# Altium project RTM_SFP.PrjPcb (part 2 of 2)

## Sheet Serial_Registers.SchDoc: Serial Registers
size 420 x 297 mm; Organization: Altium Limited; Address1: L3, 12a Rodborough Rd; Address2: Frenchs Forest; Address3: NSW; Address4: Australia 2086; SheetNumber: 6; SheetTotal: 8
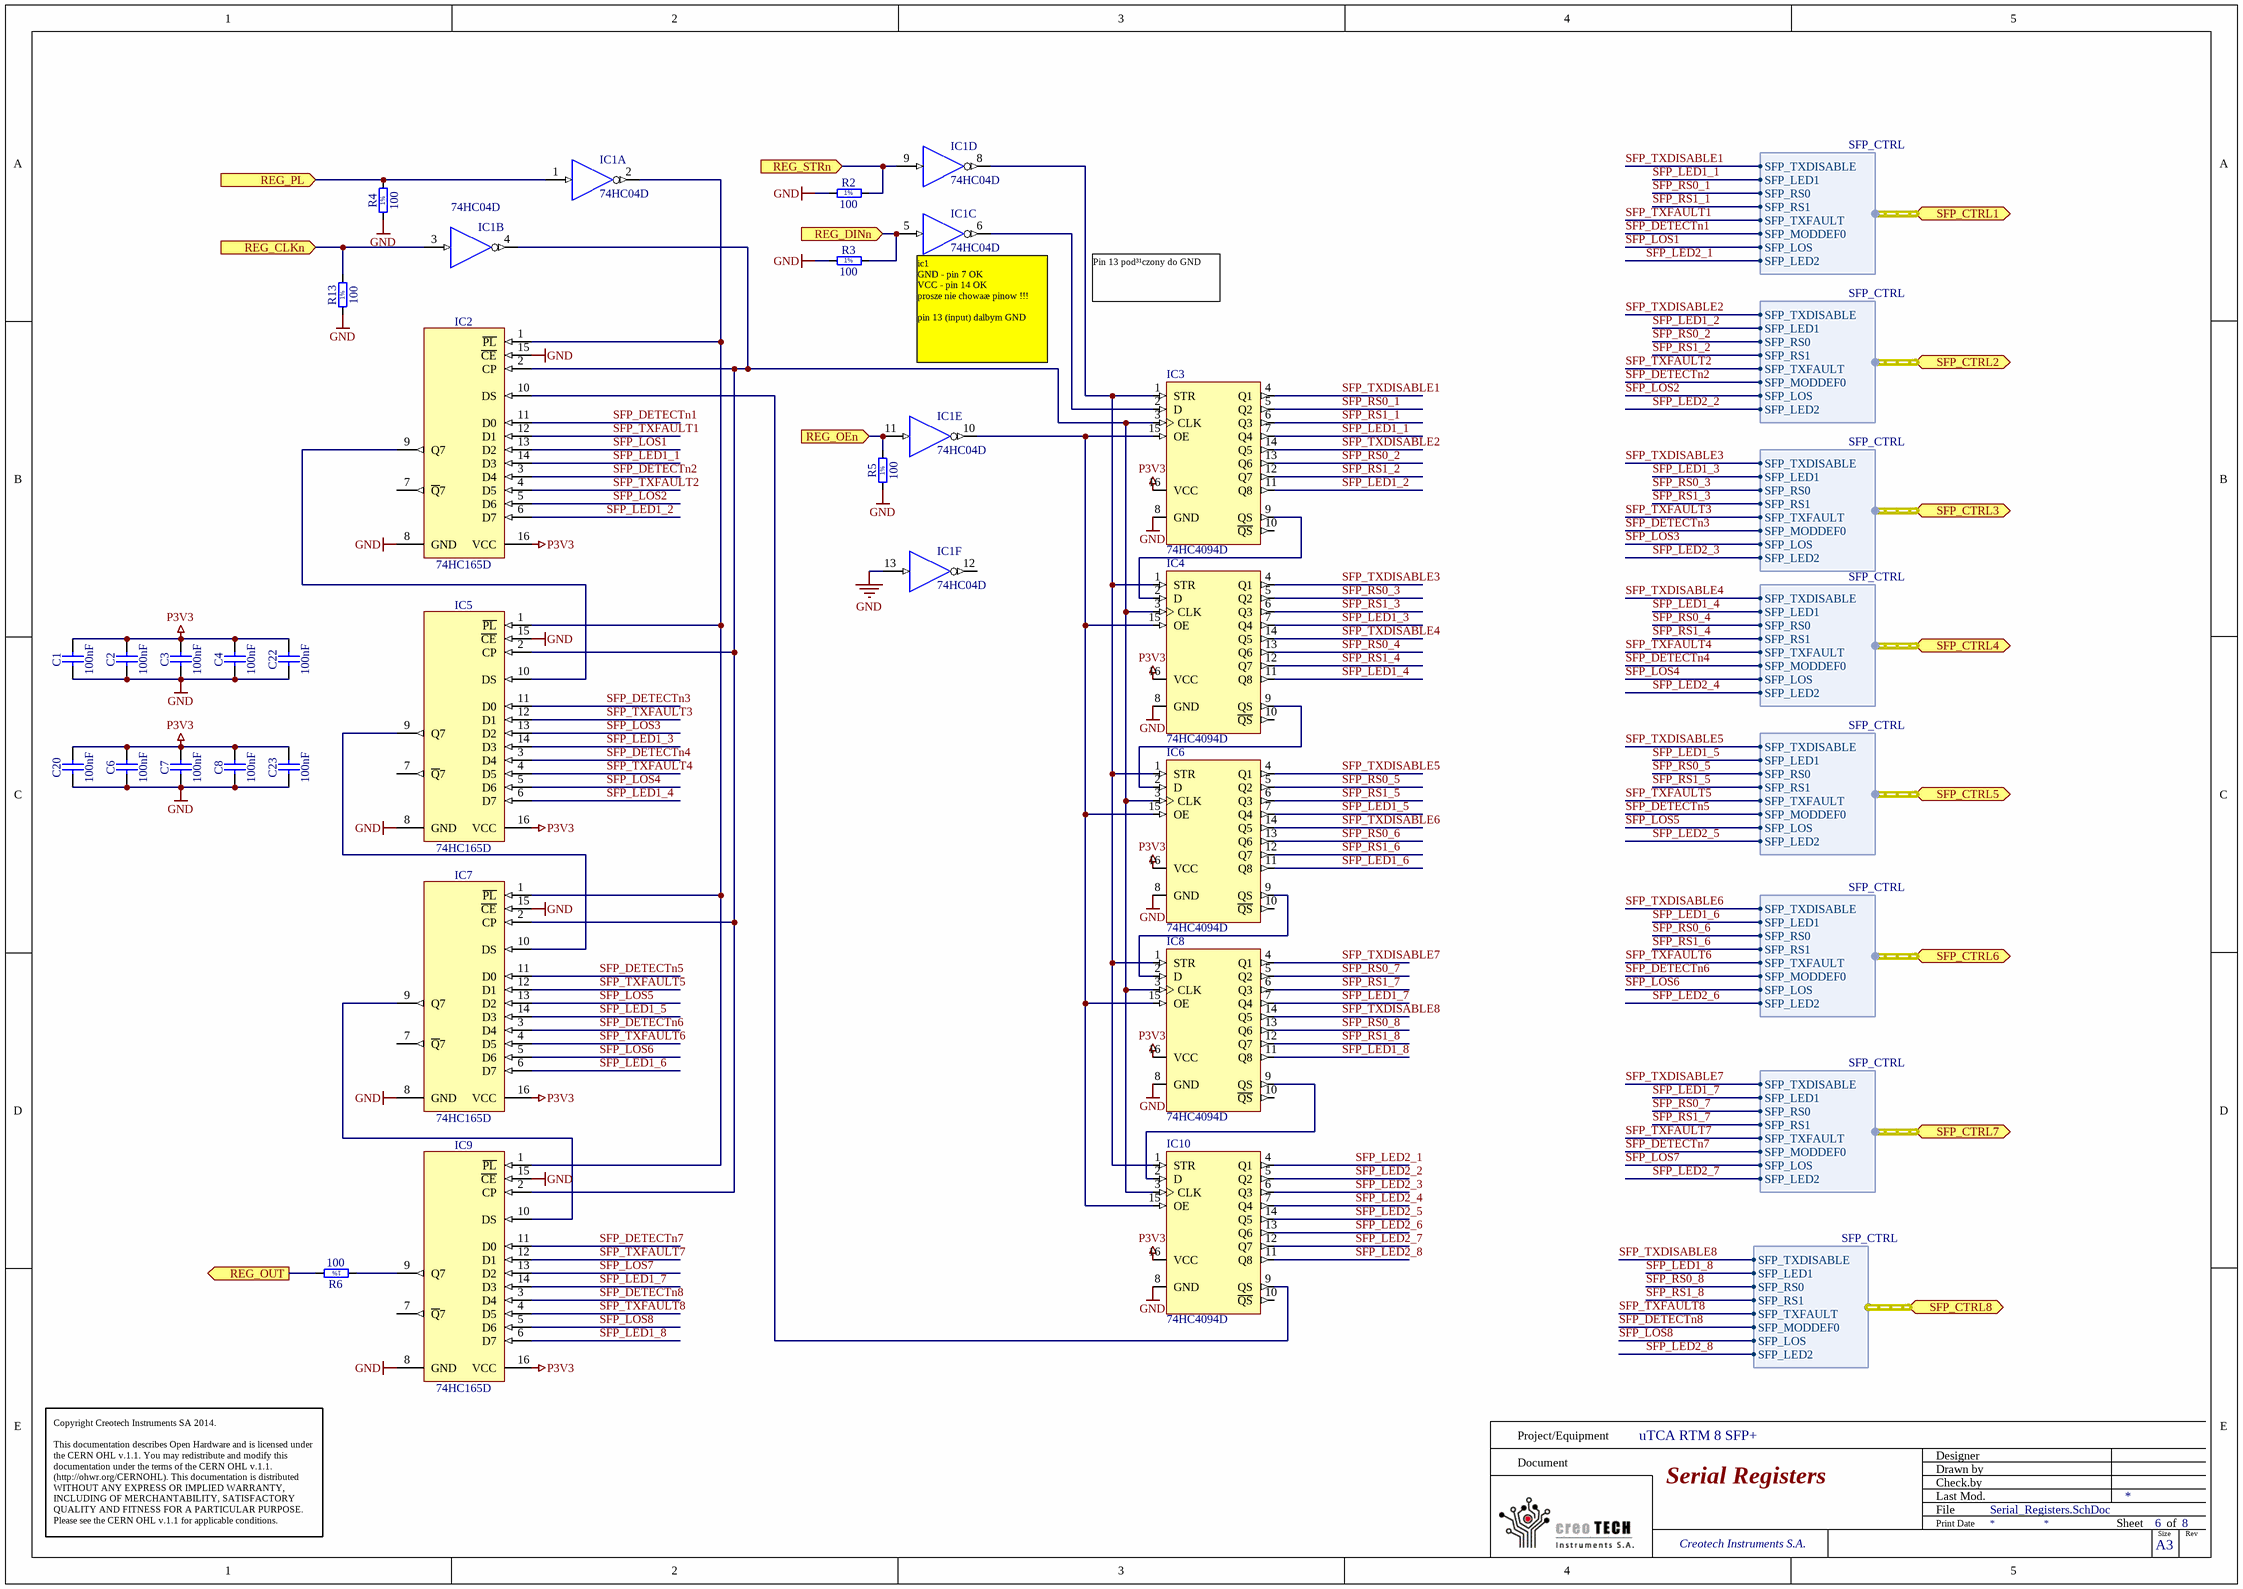
[diagram p4: Serial_Registers.SchDoc]

### Parts
C1  100nF  [CAPC1005X55N]
C2  100nF  [CAPC1005X55N]
C3  100nF  [CAPC1005X55N]
C4  100nF  [CAPC1005X55N]
C6  100nF  [CAPC1005X55N]
C7  100nF  [CAPC1005X55N]
C8  100nF  [CAPC1005X55N]
C20  100nF  [CAPC1005X55N]
C22  100nF  [CAPC1005X55N]
C23  100nF  [CAPC1005X55N]
IC1  74HC04D  [SOIC127P600X175-14N]  (parts A,B,C,D,E,F of 6)
IC2  74HC165D  [SOIC127P600X175-16N]
IC3  74HC4094D  [SO-16]
IC4  74HC4094D  [SO-16]
IC5  74HC165D  [SOIC127P600X175-16N]
IC6  74HC4094D  [SO-16]
IC7  74HC165D  [SOIC127P600X175-16N]
IC8  74HC4094D  [SO-16]
IC9  74HC165D  [SOIC127P600X175-16N]
IC10  74HC4094D  [SO-16]
R2  100  [RESC1608X55N]
R3  100  [RESC1608X55N]
R4  100  [RESC1608X55N]
R5  100  [RESC1608X55N]
R6  100  [RESC1608X55N]
R13  100  [RESC1608X55N]

### Ports
REG_CLKn (in), REG_DINn (in), REG_OEn (in), REG_OUT (out), REG_PL (in), REG_STRn (in), SFP_CTRL1 (harness SFP_CTRL), SFP_CTRL2 (harness SFP_CTRL), SFP_CTRL3 (harness SFP_CTRL), SFP_CTRL4 (harness SFP_CTRL), SFP_CTRL5 (harness SFP_CTRL), SFP_CTRL6 (harness SFP_CTRL), SFP_CTRL7 (harness SFP_CTRL), SFP_CTRL8 (harness SFP_CTRL)

### Harnesses
SFP_CTRL: SFP_LED1, SFP_TXFAULT, SFP_TXDISABLE, SFP_MODDEF0, SFP_RS0, SFP_RS1, SFP_LOS, SFP_LED2

### Nets
GND: C1.2 C2.2 C3.2 C4.2 C6.2 C7.2 C8.2 C20.2 C22.2 C23.2 IC1.7(GND) IC1.13(A) IC2.8(GND) IC2.15(~{CE}) IC3.8(GND) IC4.8(GND) IC5.8(GND) IC5.15(~{CE}) IC6.8(GND) IC7.8(GND) IC7.15(~{CE}) IC8.8(GND) IC9.8(GND) IC9.15(~{CE}) IC10.8(GND) R2.1 R3.1 R4.1 R5.1 R13.1
P3V3: C1.1 C2.1 C3.1 C4.1 C6.1 C7.1 C8.1 C20.1 C22.1 C23.1 IC1.14(VCC) IC2.16(VCC) IC3.16(VCC) IC4.16(VCC) IC5.16(VCC) IC6.16(VCC) IC7.16(VCC) IC8.16(VCC) IC9.16(VCC) IC10.16(VCC)
RTM_IO1: R6.2 ; port REG_OUT
RTM_IO2: IC1.11(A) R5.2 ; port REG_OEn
RTM_IO3: IC1.3(A) R13.2 ; port REG_CLKn
RTM_IO4: IC1.9(A) R2.2 ; port REG_STRn
RTM_IO5: IC1.5(A) R3.2 ; port REG_DINn
RTM_IO6: IC1.1(A) R4.2 ; port REG_PL
SFP_DETECTn1: IC2.11(D0) ; port SFP_CTRL1.SFP_MODDEF0
SFP_DETECTn2: IC2.3(D4) ; port SFP_CTRL2.SFP_MODDEF0
SFP_DETECTn3: IC5.11(D0) ; port SFP_CTRL3.SFP_MODDEF0
SFP_DETECTn4: IC5.3(D4) ; port SFP_CTRL4.SFP_MODDEF0
SFP_DETECTn5: IC7.11(D0) ; port SFP_CTRL5.SFP_MODDEF0
SFP_DETECTn6: IC7.3(D4) ; port SFP_CTRL6.SFP_MODDEF0
SFP_DETECTn7: IC9.11(D0) ; port SFP_CTRL7.SFP_MODDEF0
SFP_DETECTn8: IC9.3(D4) ; port SFP_CTRL8.SFP_MODDEF0
SFP_LED1_1: IC2.14(D3) IC3.7(Q4) ; port SFP_CTRL1.SFP_LED1  [project net SFP_LED1]
SFP_LED1_2: IC2.6(D7) IC3.11(Q8) ; port SFP_CTRL2.SFP_LED1  [project net SFP_LED1]
SFP_LED1_3: IC4.7(Q4) IC5.14(D3) ; port SFP_CTRL3.SFP_LED1  [project net SFP_LED1]
SFP_LED1_4: IC4.11(Q8) IC5.6(D7) ; port SFP_CTRL4.SFP_LED1  [project net SFP_LED1]
SFP_LED1_5: IC6.7(Q4) IC7.14(D3) ; port SFP_CTRL5.SFP_LED1  [project net SFP_LED1]
SFP_LED1_6: IC6.11(Q8) IC7.6(D7) ; port SFP_CTRL6.SFP_LED1  [project net SFP_LED1]
SFP_LED1_7: IC8.7(Q4) IC9.14(D3) ; port SFP_CTRL7.SFP_LED1  [project net SFP_LED1]
SFP_LED1_8: IC8.11(Q8) IC9.6(D7) ; port SFP_CTRL8.SFP_LED1  [project net SFP_LED1]
SFP_LED2_1: IC10.4(Q1) ; port SFP_CTRL1.SFP_LED2  [project net SFP_LED2]
SFP_LED2_2: IC10.5(Q2) ; port SFP_CTRL2.SFP_LED2  [project net SFP_LED2]
SFP_LED2_3: IC10.6(Q3) ; port SFP_CTRL3.SFP_LED2  [project net SFP_LED2]
SFP_LED2_4: IC10.7(Q4) ; port SFP_CTRL4.SFP_LED2  [project net SFP_LED2]
SFP_LED2_5: IC10.14(Q5) ; port SFP_CTRL5.SFP_LED2  [project net SFP_LED2]
SFP_LED2_6: IC10.13(Q6) ; port SFP_CTRL6.SFP_LED2  [project net SFP_LED2]
SFP_LED2_7: IC10.12(Q7) ; port SFP_CTRL7.SFP_LED2  [project net SFP_LED2]
SFP_LED2_8: IC10.11(Q8) ; port SFP_CTRL8.SFP_LED2  [project net SFP_LED2]
SFP_LOS1: IC2.13(D2) ; port SFP_CTRL1.SFP_LOS  [project net SFP_LOS]
SFP_LOS2: IC2.5(D6) ; port SFP_CTRL2.SFP_LOS  [project net SFP_LOS]
SFP_LOS3: IC5.13(D2) ; port SFP_CTRL3.SFP_LOS  [project net SFP_LOS]
SFP_LOS4: IC5.5(D6) ; port SFP_CTRL4.SFP_LOS  [project net SFP_LOS]
SFP_LOS5: IC7.13(D2) ; port SFP_CTRL5.SFP_LOS  [project net SFP_LOS]
SFP_LOS6: IC7.5(D6) ; port SFP_CTRL6.SFP_LOS  [project net SFP_LOS]
SFP_LOS7: IC9.13(D2) ; port SFP_CTRL7.SFP_LOS  [project net SFP_LOS]
SFP_LOS8: IC9.5(D6) ; port SFP_CTRL8.SFP_LOS  [project net SFP_LOS]
SFP_RS0_1: IC3.5(Q2) ; port SFP_CTRL1.SFP_RS0  [project net SFP_RS0]
SFP_RS0_2: IC3.13(Q6) ; port SFP_CTRL2.SFP_RS0  [project net SFP_RS0]
SFP_RS0_3: IC4.5(Q2) ; port SFP_CTRL3.SFP_RS0  [project net SFP_RS0]
SFP_RS0_4: IC4.13(Q6) ; port SFP_CTRL4.SFP_RS0  [project net SFP_RS0]
SFP_RS0_5: IC6.5(Q2) ; port SFP_CTRL5.SFP_RS0  [project net SFP_RS0]
SFP_RS0_6: IC6.13(Q6) ; port SFP_CTRL6.SFP_RS0  [project net SFP_RS0]
SFP_RS0_7: IC8.5(Q2) ; port SFP_CTRL7.SFP_RS0  [project net SFP_RS0]
SFP_RS0_8: IC8.13(Q6) ; port SFP_CTRL8.SFP_RS0  [project net SFP_RS0]
SFP_RS1_1: IC3.6(Q3) ; port SFP_CTRL1.SFP_RS1  [project net SFP_RS1]
SFP_RS1_2: IC3.12(Q7) ; port SFP_CTRL2.SFP_RS1  [project net SFP_RS1]
SFP_RS1_3: IC4.6(Q3) ; port SFP_CTRL3.SFP_RS1  [project net SFP_RS1]
SFP_RS1_4: IC4.12(Q7) ; port SFP_CTRL4.SFP_RS1  [project net SFP_RS1]
SFP_RS1_5: IC6.6(Q3) ; port SFP_CTRL5.SFP_RS1  [project net SFP_RS1]
SFP_RS1_6: IC6.12(Q7) ; port SFP_CTRL6.SFP_RS1  [project net SFP_RS1]
SFP_RS1_7: IC8.6(Q3) ; port SFP_CTRL7.SFP_RS1  [project net SFP_RS1]
SFP_RS1_8: IC8.12(Q7) ; port SFP_CTRL8.SFP_RS1  [project net SFP_RS1]
SFP_TXDISABLE1: IC3.4(Q1) ; port SFP_CTRL1.SFP_TXDISABLE  [project net SFP_TXDISABLE]
SFP_TXDISABLE2: IC3.14(Q5) ; port SFP_CTRL2.SFP_TXDISABLE  [project net SFP_TXDISABLE]
SFP_TXDISABLE3: IC4.4(Q1) ; port SFP_CTRL3.SFP_TXDISABLE  [project net SFP_TXDISABLE]
SFP_TXDISABLE4: IC4.14(Q5) ; port SFP_CTRL4.SFP_TXDISABLE  [project net SFP_TXDISABLE]
SFP_TXDISABLE5: IC6.4(Q1) ; port SFP_CTRL5.SFP_TXDISABLE  [project net SFP_TXDISABLE]
SFP_TXDISABLE6: IC6.14(Q5) ; port SFP_CTRL6.SFP_TXDISABLE  [project net SFP_TXDISABLE]
SFP_TXDISABLE7: IC8.4(Q1) ; port SFP_CTRL7.SFP_TXDISABLE  [project net SFP_TXDISABLE]
SFP_TXDISABLE8: IC8.14(Q5) ; port SFP_CTRL8.SFP_TXDISABLE  [project net SFP_TXDISABLE]
SFP_TXFAULT1: IC2.12(D1) ; port SFP_CTRL1.SFP_TXFAULT  [project net SFP_TXFAULT]
SFP_TXFAULT2: IC2.4(D5) ; port SFP_CTRL2.SFP_TXFAULT  [project net SFP_TXFAULT]
SFP_TXFAULT3: IC5.12(D1) ; port SFP_CTRL3.SFP_TXFAULT  [project net SFP_TXFAULT]
SFP_TXFAULT4: IC5.4(D5) ; port SFP_CTRL4.SFP_TXFAULT  [project net SFP_TXFAULT]
SFP_TXFAULT5: IC7.12(D1) ; port SFP_CTRL5.SFP_TXFAULT  [project net SFP_TXFAULT]
SFP_TXFAULT6: IC7.4(D5) ; port SFP_CTRL6.SFP_TXFAULT  [project net SFP_TXFAULT]
SFP_TXFAULT7: IC9.12(D1) ; port SFP_CTRL7.SFP_TXFAULT  [project net SFP_TXFAULT]
SFP_TXFAULT8: IC9.4(D5) ; port SFP_CTRL8.SFP_TXFAULT  [project net SFP_TXFAULT]
NetIC1_2: IC1.2(~{O}) IC2.1(~{PL}) IC5.1(~{PL}) IC7.1(~{PL}) IC9.1(~{PL})
NetIC1_4: IC1.4(~{O}) IC2.2(CP) IC3.3(CLK) IC4.3(CLK) IC5.2(CP) IC6.3(CLK) IC7.2(CP) IC8.3(CLK) IC9.2(CP) IC10.3(CLK)
NetIC1_6: IC1.6(~{O}) IC3.2(D)
NetIC1_8: IC1.8(~{O}) IC3.1(STR) IC4.1(STR) IC6.1(STR) IC8.1(STR) IC10.1(STR)
NetIC1_10: IC1.10(~{O}) IC3.15(OE) IC4.15(OE) IC6.15(OE) IC8.15(OE) IC10.15(OE)
NetIC2_9: IC2.9(Q7) IC5.10(DS)
NetIC2_10: IC2.10(DS) IC10.9(QS)
NetIC3_9: IC3.9(QS) IC4.2(D)
NetIC4_9: IC4.9(QS) IC6.2(D)
NetIC5_9: IC5.9(Q7) IC7.10(DS)
NetIC6_9: IC6.9(QS) IC8.2(D)
NetIC7_9: IC7.9(Q7) IC9.10(DS)
NetIC8_9: IC8.9(QS) IC10.2(D)
NetIC9_9: IC9.9(Q7) R6.1

Not connected (* = marked no-connect by the designer): IC1 12(~{O}); IC2 7(~{Q}7); IC3 10(~{QS}); IC4 10(~{QS}); IC5 7(~{Q}7); IC6 10(~{QS}); IC7 7(~{Q}7); IC8 10(~{QS}); IC9 7(~{Q}7); IC10 10(~{QS})

### Notes on the sheet
- Pin 13 pod³¹czony do GND
- (near IC1) ic1
  GND - pin 7 OK
  VCC - pin 14 OK
  prosze nie chowaæ pinow !!!
  pin 13 (input) dalbym GND
- Project/Equipment
- Document
- uTCA RTM 8 SFP+
- Designer
- Drawn by
- Check.by
- Copyright Creotech Instruments SA 2014.
  This documentation describes Open Hardware and is licensed under the CERN OHL v.1.1. You may redistribute and modify this documentation under the terms of the CERN OHL v.1.1. (http://ohwr.org/CERNOHL). This documentation is distributed WITHOUT ANY EXPRESS OR IMPLIED WARRANTY, INCLUDING OF MERCHANTABILITY, SATISFACTORY QUALITY AND FITNESS FOR A PARTICULAR PURPOSE. Please see the CERN OHL v.1.1 for applicable conditions.
- Creotech Instruments S.A.
- File
- Last Mod.
- Print Date
- Sheet
- Size
- A3
- of
- Rev
- (in symbol R0603_100R_1%_0.1W_100PPM) 1%

### Library data of the parts
C1-C4 C6-C8 C20 C22 C23 = CC0402_100NF_16V_10%_X7R: Non-polarised capacitor; Part Description: SMD Multilayer Chip Ceramic Capacitor; Manufacturer: GENERIC; Manufacturer1 Part Number: 223878715649; Voltage: 16V; TC: X7R; Tolerance: ±10%; Table: Capacitors SMD; Part Number: CC0402_100NF_16V_10%_X7R; Component Kind: Standard; Component Type: Standard; Pin Count: 2; Value: 100nF; Status: Not Recommended; Manufacturer Part Number: CC0402_100NF_16V_10%_X7R; Case: 0402; Mounted: Yes; Socket: No; SMD: Yes; Manufacturer1 Example: PHYCOMP; Manufacturer1 ComponentHeight: 0.55mm; HelpURL: \\cern.ch\dfs\Applications\Altium\Datasheets\CC0402_X7R_PHYCOMP.pdf; Author: CERN DEM JLC; CreateDate: 12/3/2007; LatestRevisionDate: 12/3/2007
IC1 = 74HC04D: Hex Inverter; Part Description: Hex Inverters; Manufacturer: NXP SEMICONDUCTORS; Table: Standard Logic; Part Number: 74HC04D; Component Kind: Standard; Component Type: Standard; Device: 74HC04D; PackageDescription: SOIC 14, Pitch 1.27mm - Body 4x8.75mm, IPC Medium Density; Manufacturer Part Number: 74HC04D; Pin Count: 12; Case: SOIC14; Mounted: Yes; Socket: No; SMD: Yes; ComponentHeight: 1.75mm; Author: CERN DEM JLC; HelpURL: \\cern.ch\dfs\Applications\Altium\Datasheets\74HC04D.pdf; CreateDate: 2011-04-06; LatestRevisionDate: 2011-04-06
IC2 IC5 IC7 IC9 = 74HC165D: 8-Bit Parallel-In/Serial Out Shift Register; Manufacturer: NXP SEMICONDUCTORS; Table: Standard Logic; Part Number: 74HC165D; Component Kind: Standard; Component Type: Standard; Device: 74HC165D; PackageDescription: SOIC 16, Pitch 1.27mm - Body 4x10mm, IPC Medium Density; Part Description: 8-Bit Parallel-In/Serial Out Shift Register; Manufacturer Part Number: 74HC165D; Pin Count: 16; Case: SOIC16; Mounted: Yes; Socket: No; SMD: Yes; ComponentHeight: 1.75mm; Author: CERN DEM JLC; HelpURL: \\cern.ch\dfs\Applications\Altium\Datasheets\74HC165D.pdf; CreateDate: 2012-04-26; LatestRevisionDate: 2012-04-26
IC3 IC4 IC6 IC8 IC10 = 4094: shift register
R2-R6 R13 = R0603_100R_1%_0.1W_100PPM: Resistor - 1%; Part Description: General Purpose Thick Film Chip Resistor; Manufacturer: GENERIC; Manufacturer1 Part Number: NRC06F4700TRF; Power: 0.1W; TC: ±100ppm/°C; Table: Resistors SMD; Part Number: R0603_100R_1%_0.1W_100PPM; Component Kind: Standard; Component Type: Standard; Pin Count: 2; Value: 100; Status: Preferred; Tolerance: ±1%; Manufacturer Part Number: R0603_100R_1%_0.1W_100PPM; Case: 0603; Mounted: Yes; Socket: No; SMD: Yes; Manufacturer1 Example: NIC COMPONENT; Manufacturer1 ComponentHeight: 0.55mm; HelpURL: \\cern.ch\dfs\Applications\Altium\Datasheets\R0603_NIC_NRC.pdf; Author: CERN DEM JLC; CreateDate: 12/3/2007; LatestRevisionDate: 3/13/2008

## Sheet RTM_Connectors.SchDoc
size A3; Organization: Altium Limited; Address1: L3, 12a Rodborough Rd; Address2: Frenchs Forest; Address3: NSW; Address4: Australia 2086
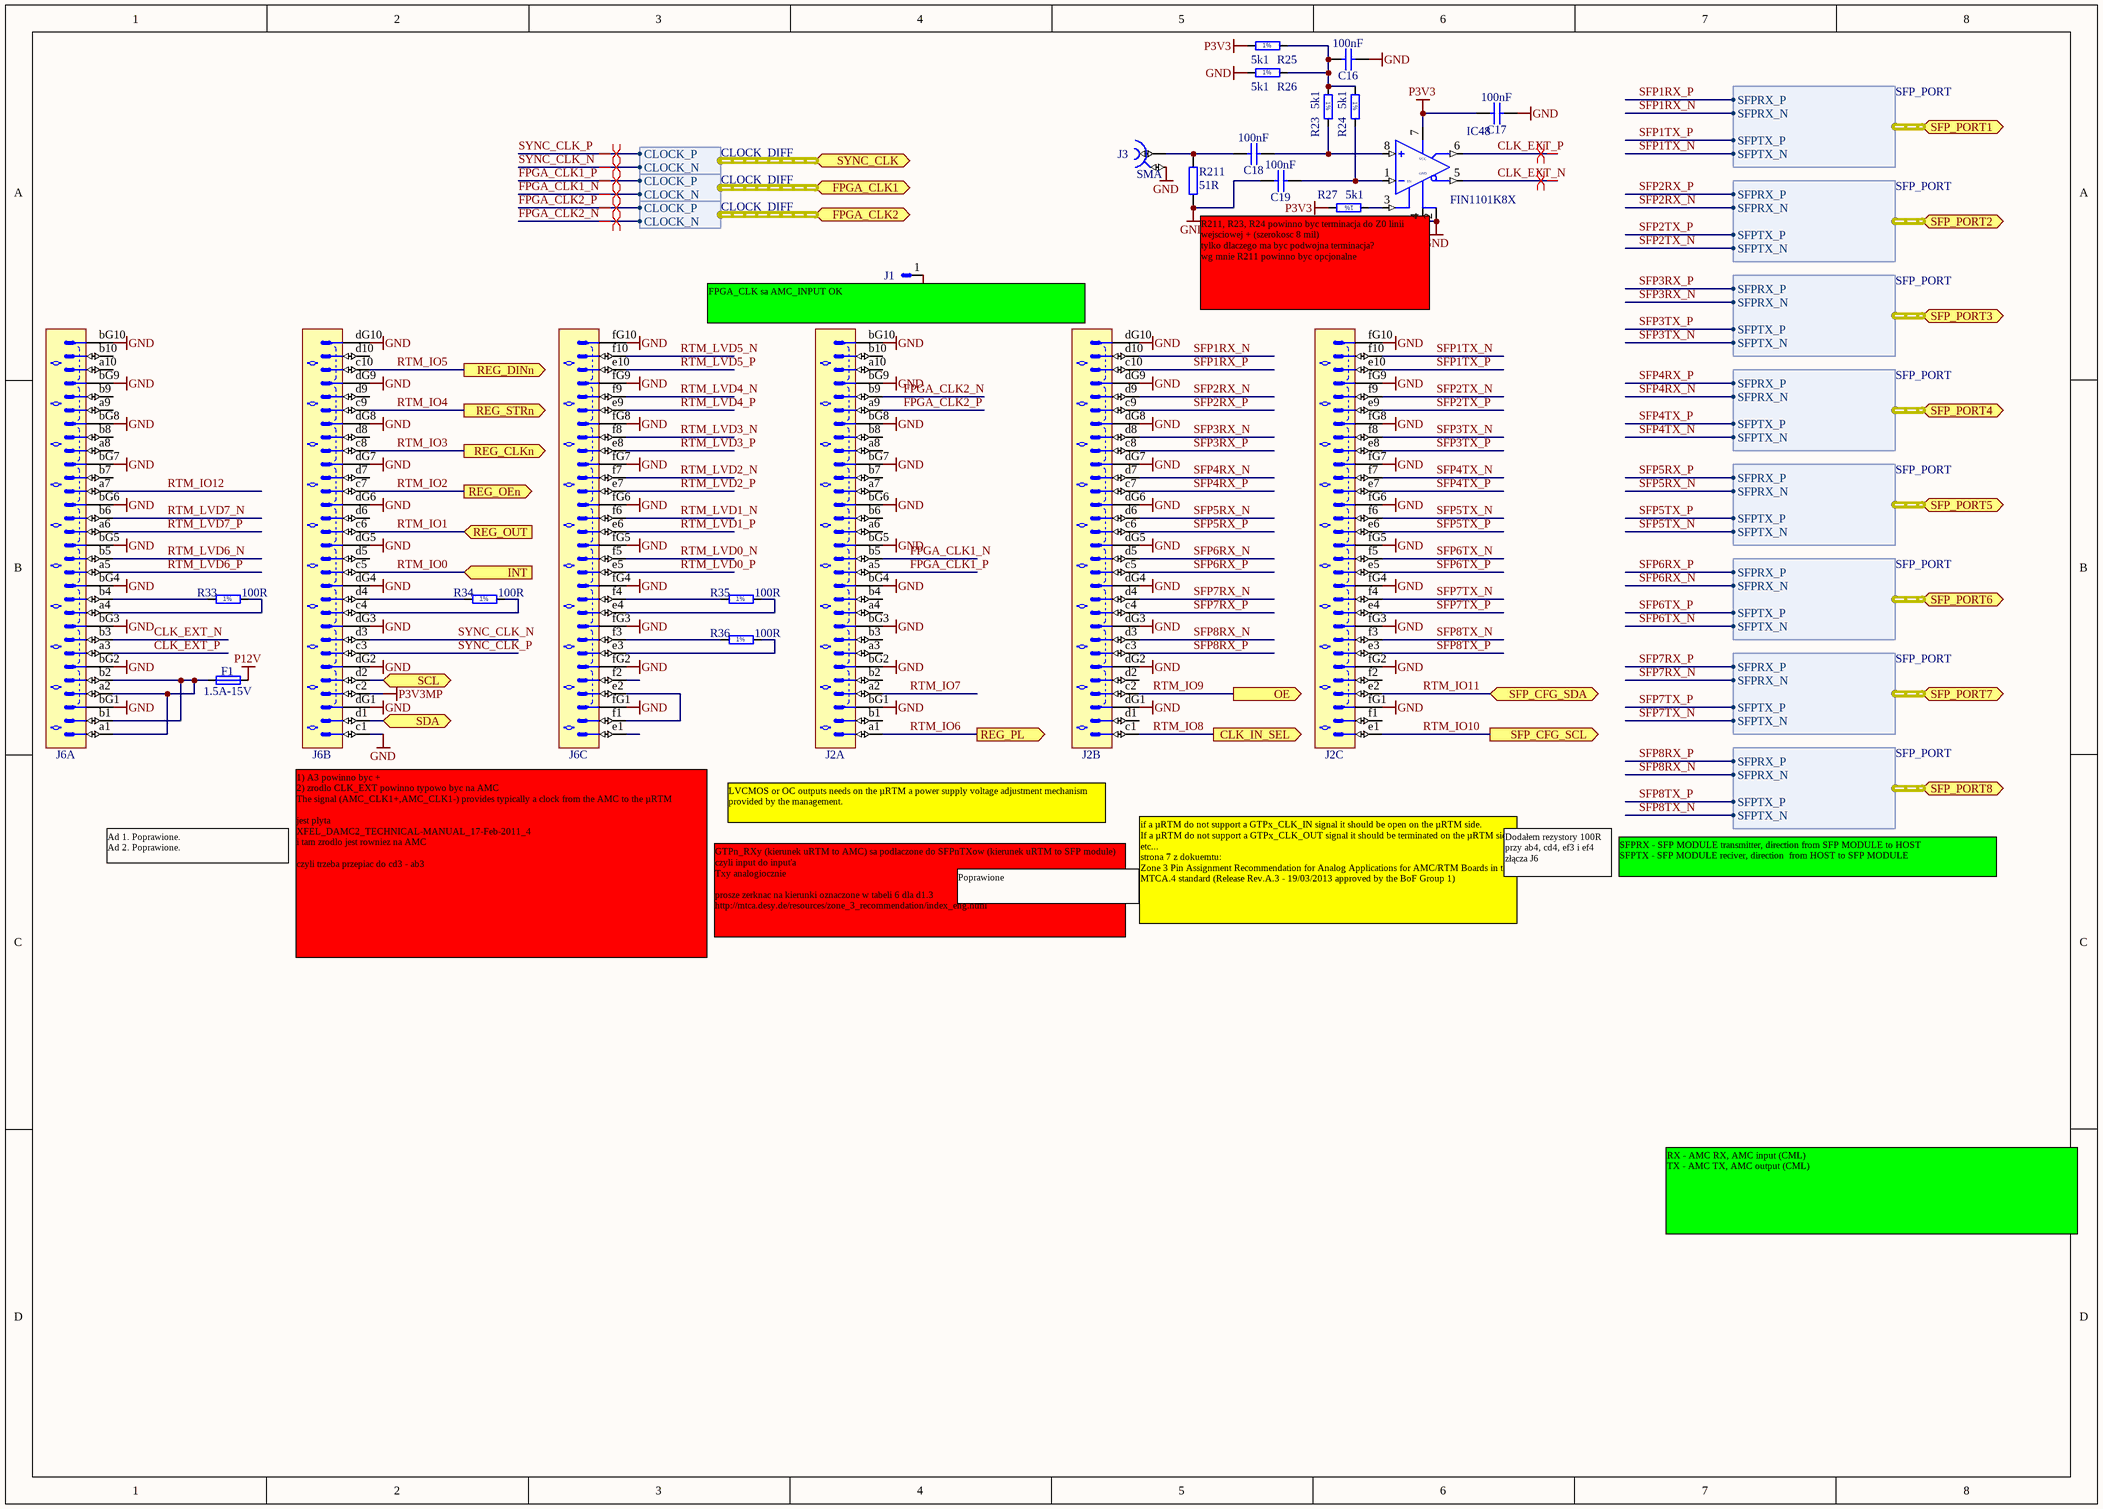
[diagram p5: RTM_Connectors.SchDoc]

### Parts
C16  100nF  [CAPC1005X55N]
C17  100nF  [CAPC1005X55N]
C18  100nF  [CAPC1005X55N]
C19  100nF  [CAPC1005X55N]
F1  1.5A-15V  [FUSR_TYCO_SMD150F-2]
IC48  FIN1101K8X  [US8]
J1  (no value)  [TYCO_1469265-1]
J2  (no value)  [TYCO_6469183-1]  (parts A,B,C of 3)
J3  SMA  [HUBER-SUHNER_85 SMA-50-0-101/111 NE]
J6  (no value)  [TYCO_6469183-1]  (parts A,B,C of 3)
R23  5k1  [RESC1608X55N]
R24  5k1  [RESC1608X55N]
R25  5k1  [RESC1608X55N]
R26  5k1  [RESC1608X55N]
R27  5k1  [RESC1608X55N]
R33  100R  [RESC1608X55N]
R34  100R  [RESC1608X55N]
R35  100R  [RESC1608X55N]
R36  100R  [RESC1608X55N]
R211  51R  [0402R]

### Ports
CLK_IN_SEL (out), FPGA_CLK1 (harness CLOCK_DIFF), FPGA_CLK2 (harness CLOCK_DIFF), INT (in), OE (out), REG_CLKn (out), REG_DINn (out), REG_OEn (out), REG_OUT (in), REG_PL (out), REG_STRn (out), SCL (bidir), SDA (bidir), SFP_CFG_SCL (out), SFP_CFG_SDA (bidir), SFP_PORT1 (harness SFP_PORT), SFP_PORT2 (harness SFP_PORT), SFP_PORT3 (harness SFP_PORT), SFP_PORT4 (harness SFP_PORT), SFP_PORT5 (harness SFP_PORT), SFP_PORT6 (harness SFP_PORT), SFP_PORT7 (harness SFP_PORT), SFP_PORT8 (harness SFP_PORT), SYNC_CLK (harness CLOCK_DIFF)

### Harnesses
SFP_PORT: SFPRX_P, SFPRX_N, SFPTX_P, SFPTX_N
CLOCK_DIFF: CLOCK_P, CLOCK_N

### Nets
GND: C16.2 C17.2 C19.1 IC48.2(GND) IC48.4(GND) J1.1 J2.bG1 J2.bG2 J2.bG3 J2.bG4 J2.bG5 J2.bG6 J2.bG7 J2.bG8 J2.bG9 J2.bG10 J2.dG1 J2.dG2 J2.dG3 J2.dG4 J2.dG5 J2.dG6 J2.dG7 J2.dG8 J2.dG9 J2.dG10 J2.fG1 J2.fG2 J2.fG3 J2.fG4 J2.fG5 J2.fG6 J2.fG7 J2.fG8 J2.fG9 J2.fG10 J3.2 J6.bG1 J6.bG2 J6.bG3 J6.bG4 J6.bG5 J6.bG6 J6.bG7 J6.bG8 J6.bG9 J6.bG10 J6.c1 J6.dG1 J6.dG2 J6.dG3 J6.dG4 J6.dG5 J6.dG6 J6.dG7 J6.dG8 J6.dG9 J6.dG10 J6.fG1 J6.fG2 J6.fG3 J6.fG4 J6.fG5 J6.fG6 J6.fG7 J6.fG8 J6.fG9 J6.fG10 R26.1 R211.2
P3V3: C17.1 IC48.7(VCC) R25.1 R27.2
P3V3MP: J6.c2
P12V: F1.2
CLK_EXT_N: IC48.5(~{Q}) J6.b3
CLK_EXT_P: IC48.6(Q) J6.a3
FPGA_CLK1_N: J2.b5 ; port FPGA_CLK1.CLOCK_N
FPGA_CLK1_P: J2.a5 ; port FPGA_CLK1.CLOCK_P
FPGA_CLK2_N: J2.b9 ; port FPGA_CLK2.CLOCK_N
FPGA_CLK2_P: J2.a9 ; port FPGA_CLK2.CLOCK_P
RTM_IO0: J6.c5 ; port INT
RTM_IO1: J6.c6 ; port REG_OUT
RTM_IO2: J6.c7 ; port REG_OEn
RTM_IO3: J6.c8 ; port REG_CLKn
RTM_IO4: J6.c9 ; port REG_STRn
RTM_IO5: J6.c10 ; port REG_DINn
RTM_IO6: J2.a1 ; port REG_PL
RTM_IO7: J2.a2
RTM_IO8: J2.c1 ; port CLK_IN_SEL
RTM_IO9: J2.c2 ; port OE
RTM_IO10: J2.e1 ; port SFP_CFG_SCL
RTM_IO11: J2.e2 ; port SFP_CFG_SDA
RTM_IO12: J6.a7
RTM_LVD0_N: J6.f5
RTM_LVD0_P: J6.e5
RTM_LVD1_N: J6.f6
RTM_LVD1_P: J6.e6
RTM_LVD2_N: J6.f7
RTM_LVD2_P: J6.e7
RTM_LVD3_N: J6.f8
RTM_LVD3_P: J6.e8
RTM_LVD4_N: J6.f9
RTM_LVD4_P: J6.e9
RTM_LVD5_N: J6.f10
RTM_LVD5_P: J6.e10
RTM_LVD6_N: J6.b5
RTM_LVD6_P: J6.a5
RTM_LVD7_N: J6.b6
RTM_LVD7_P: J6.a6
SFP1RX_N: J2.d10 ; port SFP_PORT1.SFPRX_N
SFP1RX_P: J2.c10 ; port SFP_PORT1.SFPRX_P
SFP1TX_N: J2.f10 ; port SFP_PORT1.SFPTX_N
SFP1TX_P: J2.e10 ; port SFP_PORT1.SFPTX_P
SFP2RX_N: J2.d9 ; port SFP_PORT2.SFPRX_N
SFP2RX_P: J2.c9 ; port SFP_PORT2.SFPRX_P
SFP2TX_N: J2.f9 ; port SFP_PORT2.SFPTX_N
SFP2TX_P: J2.e9 ; port SFP_PORT2.SFPTX_P
SFP3RX_N: J2.d8 ; port SFP_PORT3.SFPRX_N
SFP3RX_P: J2.c8 ; port SFP_PORT3.SFPRX_P
SFP3TX_N: J2.f8 ; port SFP_PORT3.SFPTX_N
SFP3TX_P: J2.e8 ; port SFP_PORT3.SFPTX_P
SFP4RX_N: J2.d7 ; port SFP_PORT4.SFPRX_N
SFP4RX_P: J2.c7 ; port SFP_PORT4.SFPRX_P
SFP4TX_N: J2.f7 ; port SFP_PORT4.SFPTX_N
SFP4TX_P: J2.e7 ; port SFP_PORT4.SFPTX_P
SFP5RX_N: J2.d6 ; port SFP_PORT5.SFPRX_N
SFP5RX_P: J2.c6 ; port SFP_PORT5.SFPRX_P
SFP5TX_N: J2.f6 ; port SFP_PORT5.SFPTX_N
SFP5TX_P: J2.e6 ; port SFP_PORT5.SFPTX_P
SFP6RX_N: J2.d5 ; port SFP_PORT6.SFPRX_N
SFP6RX_P: J2.c5 ; port SFP_PORT6.SFPRX_P
SFP6TX_N: J2.f5 ; port SFP_PORT6.SFPTX_N
SFP6TX_P: J2.e5 ; port SFP_PORT6.SFPTX_P
SFP7RX_N: J2.d4 ; port SFP_PORT7.SFPRX_N
SFP7RX_P: J2.c4 ; port SFP_PORT7.SFPRX_P
SFP7TX_N: J2.f4 ; port SFP_PORT7.SFPTX_N
SFP7TX_P: J2.e4 ; port SFP_PORT7.SFPTX_P
SFP8RX_N: J2.d3 ; port SFP_PORT8.SFPRX_N
SFP8RX_P: J2.c3 ; port SFP_PORT8.SFPRX_P
SFP8TX_N: J2.f3 ; port SFP_PORT8.SFPTX_N
SFP8TX_P: J2.e3 ; port SFP_PORT8.SFPTX_P
SYNC_CLK_N: J6.d3 ; port SYNC_CLK.CLOCK_N
SYNC_CLK_P: J6.c3 ; port SYNC_CLK.CLOCK_P
NetC16_1: C16.1 R23.1 R24.1 R25.2 R26.2
NetC18_1: C18.1 J3.1 R211.1
NetC18_2: C18.2 IC48.8(IN) R23.2
NetC19_2: C19.2 IC48.1(IN) R24.2
NetF1_1: F1.1 J6.a1 J6.a2 J6.b1 J6.b2
NetIC12_1: J6.d1 ; port SDA
NetIC12_2: J6.d2 ; port SCL
NetIC48_3: IC48.3(EN) R27.1
NetJ6_a4: J6.a4 R33.2
NetJ6_b4: J6.b4 R33.1
NetJ6_c4: J6.c4 R34.2
NetJ6_d4: J6.d4 R34.1
NetJ6_e2: J6.e2 J6.f1
NetJ6_e3: J6.e3 R36.2
NetJ6_e4: J6.e4 R35.2
NetJ6_f3: J6.f3 R36.1
NetJ6_f4: J6.f4 R35.1

Not connected (* = marked no-connect by the designer): J2 a3 a4 a6 a7 a8 a10 b1 b2 b3 b4 b6 b7 b8 b10 d1 d2 f1 f2; J6 a8 a9 a10 b7 b8 b9 b10 d5 d6 d7 d8 d9 d10 e1 f2

### Layout directives
differential pair: CLK_EXT_N, CLK_EXT_P, FPGA_CLK1_N, FPGA_CLK1_P, FPGA_CLK2_N, FPGA_CLK2_P, SYNC_CLK_N, SYNC_CLK_P

### Notes on the sheet
- (near J1) FPGA_CLK sa AMC_INPUT OK
- R211, R23, R24 powinno byc terminacja do Z0 linii wejsciowej + (szerokosc 8 mil)
  tylko dlaczego ma byc podwojna terminacja?
  wg mnie R211 powinno byc opcjonalne
- Ad 1. Poprawione.
  Ad 2. Poprawione.
- (near J2) LVCMOS or OC outputs needs on the µRTM a power supply voltage adjustment mechanism provided by the management.
- Poprawione
- if a µRTM do not support a GTPx_CLK_IN signal it should be open on the µRTM side.
  If a µRTM do not support a GTPx_CLK_OUT signal it should be terminated on the µRTM side.
  etc...
  strona 7 z dokuemtu:
  Zone 3 Pin Assignment Recommendation for Analog Applications for AMC/RTM Boards in the MTCA.4 standard (Release Rev.A.3 - 19/03/2013 approved by the BoF Group 1)
- Dodałem rezystory 100R przy ab4, cd4, ef3 i ef4 złącza J6
- SFPRX - SFP MODULE transmitter, direction from SFP MODULE to HOST
  SFPTX - SFP MODULE reciver, direction  from HOST to SFP MODULE
- (near J6) 1) A3 powinno byc +
  2) zrodlo CLK_EXT powinno typowo byc na AMC
  The signal (AMC_CLK1+,AMC_CLK1-) provides typically a clock from the AMC to the µRTM
  jest plyta
  XFEL_DAMC2_TECHNICAL-MANUAL_17-Feb-2011_4
  i tam zrodlo jest rowniez na AMC
  czyli trzeba przepiac do cd3 - ab3
- GTPn_RXy (kierunek uRTM to AMC) sa podlaczone do SFPnTXow (kierunek uRTM to SFP module)
  czyli input do input'a
  Txy analogiocznie
  prosze zerknac na kierunki oznaczone w tabeli 6 dla d1.3
  http://mtca.desy.de/resources/zone_3_recommendation/index_eng.html
- RX - AMC RX, AMC input (CML)
  TX - AMC TX, AMC output (CML)
- (in symbol R0603_5K1_1%_0.1W_100PPM) 1%

### Library data of the parts
C16-C19 = CC0402_100NF_16V_10%_X7R: as C1 on sheet Serial_Registers; Part Number: CC0402_100NF_16V_10%_X7R; Component Kind: Standard; Component Type: Standard; Pin Count: 2; Value: 100nF; Status: Not Recommended; Manufacturer Part Number: CC0402_100NF_16V_10%_X7R; Case: 0402; Mounted: Yes; Socket: No; SMD: Yes; Manufacturer1 Example: PHYCOMP; Manufacturer1 ComponentHeight: 0.55mm; HelpURL: \\cern.ch\dfs\Applications\Altium\Datasheets\CC0402_X7R_PHYCOMP.pdf; Author: CERN DEM JLC; CreateDate: 12/3/2007; LatestRevisionDate: 12/3/2007
F1 = FUSR_TYCO_SMD150F-2: Fuse; Part Description: PolySwitch® PTC Overcurrent Protection Device; Manufacturer: TYCO ELECTRONICS; Table: Fuses; Part Number: FUSR_TYCO_SMD150F-2; Component Kind: Standard; Component Type: Standard; Pin Count: 2; PackageDescription: PolySwitch, 2-Leads, Body 8.7x6.35mm Nominal; Family: Fuses Resettable; Mounted: Yes; Socket: No; SMD: Yes; Value: 1.5A-15V; Manufacturer Part Number: SMD150F-2; ComponentHeight: 3mm; HelpURL: \\cern.ch\dfs\Applications\Altium\Datasheets\FUSR_TYCO_SMD150F-2.pdf; Author: CERN DEM JLC; CreateDate: 2010-03-17; LatestRevisionDate: 2010-03-17
IC48 = IFC_FIN1101K8X: LVDS TO LVDS repeater3.3V
J1 = TYCO_1469265-1: Single Pin Male; Part Number: TYCO_1469265-1
J2 J6 = TYCO_6469183-1: Connector 60 ATCA Male 30 Pairs (60 Signals) + 3x10 Ground; Part Number: TYCO_6469183-1
J3 = HUBER-SUHNER_85_SMA-50-0-101/111_NE: Part Description: SMA 50 Ohms Right Angle PCB Jack; Manufacturer: HUBER+SUHNER; Table: Miscellaneous; Part Number: HUBER-SUHNER_85_SMA-50-0-101/111_NE; Component Kind: Standard; Component Type: Standard; Pin Count: 2; Family: SMA; Mounted: Yes; Socket: No; SMD: No; Status: None; Manufacturer Part Number: 85_SMA-50-0-101/111_NE; ComponentHeight: 9.6mm; HelpURL: \\cern.ch\dfs\Applications\Altium\Datasheets\HUBER-SUHNER_85 SMA-50-0-101-111 NE.pdf; Author: CERN DEM JLC; CreateDate: 2010-04-20; LatestRevisionDate: 2010-04-27
R23-R27 R33-R36 = R0603_5K1_1%_0.1W_100PPM: Resistor - 1%; Part Description: General Purpose Thick Film Chip Resistor; Manufacturer: GENERIC; Manufacturer1 Part Number: NRC06F5101TRF; Power: 0.1W; TC: ±100ppm/°C; Table: Resistors SMD; Part Number: R0603_5K1_1%_0.1W_100PPM; Component Kind: Standard; Component Type: Standard; Pin Count: 2; Status: Preferred; Tolerance: ±1%; Manufacturer Part Number: R0603_5K1_1%_0.1W_100PPM; Case: 0603; Mounted: Yes; Socket: No; SMD: Yes; Manufacturer1 Example: NIC COMPONENT; Manufacturer1 ComponentHeight: 0.55mm; HelpURL: \\cern.ch\dfs\Applications\Altium\Datasheets\R0603_NIC_NRC.pdf; Author: CERN DEM JLC; CreateDate: 03/12/2007; LatestRevisionDate: 13/03/2008
  R23-R27: Value: 5k1
  R33-R36: Value: 100R
R211 = RES_0402: SMD Resistor; Supplier 1: Newark; Supplier Part Number 1: 59M6691

## Sheet USR_IO_IPMI.SchDoc: USER IO IPMI
size 420 x 297 mm; Organization: Altium Limited; Address1: L3, 12a Rodborough Rd; Address2: Frenchs Forest; Address3: NSW; Address4: Australia 2086; SheetNumber: 8; SheetTotal: 8
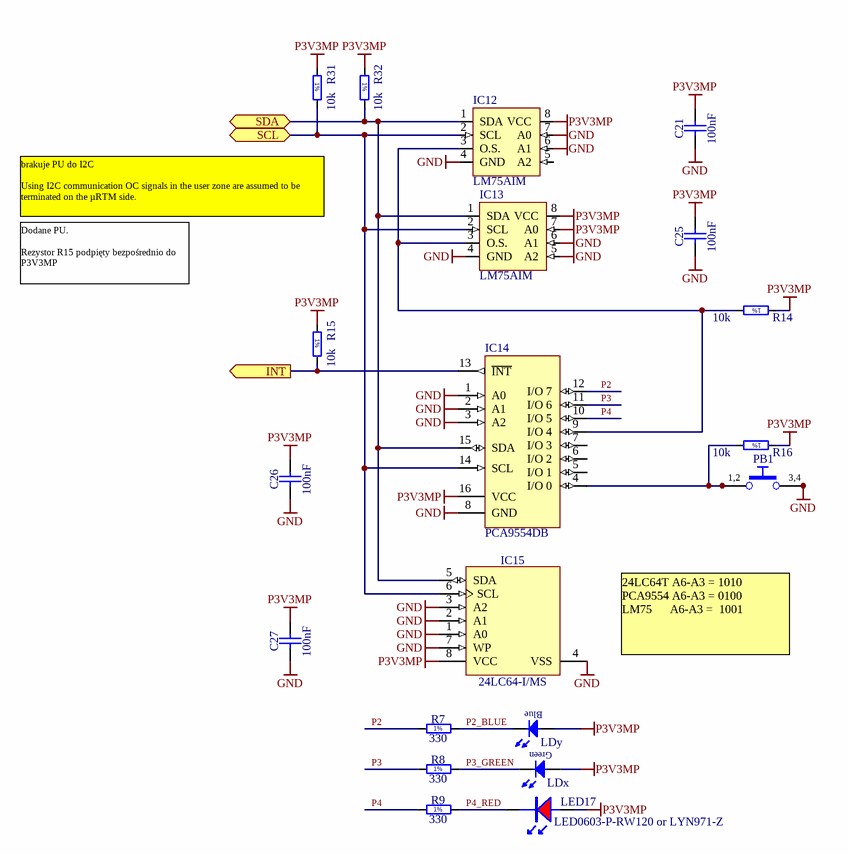
[diagram p6: USR_IO_IPMI.SchDoc]

### Parts
C21  100nF  [CAPC1005X55N]
C25  100nF  [CAPC1005X55N]
C26  100nF  [CAPC1005X55N]
C27  100nF  [CAPC1005X55N]
IC12  LM75AIM  [SOIC127P600X175-8N]
IC13  LM75AIM  [SOIC127P600X175-8N]
IC14  PCA9554DB  [SOP65P640X120-16N]
IC15  24LC64-I/MS  [SOP65P490X110-8N]
LDx  Green  [LED_AVAGO_HSME-C120]  (value not drawn)
LDy  Blue  [LED_AVAGO_HSME-C120]  (value not drawn)
LED17  LED0603-P-RW120 or LYN971-Z  [led_0603R]
PB1  Push Button  [SW_C&K_HDT0001]  (value not drawn)
R7  330  [RESC1608X55N]
R8  330  [RESC1608X55N]
R9  330  [RESC1608X55N]
R14  10k  [RESC1005X40N]
R15  10k  [RESC1005X40N]
R16  10k  [RESC1005X40N]
R31  10k  [RESC1005X40N]
R32  10k  [RESC1005X40N]

### Ports
INT (out), SCL (bidir), SDA (bidir)

### Nets
GND: C21.2 C25.2 C26.2 C27.2 IC12.4(GND) IC12.6(A1) IC12.7(A0) IC13.4(GND) IC13.5(A2) IC13.6(A1) IC14.1(A0) IC14.2(A1) IC14.3(A2) IC14.8(GND) IC15.1(A0) IC15.2(A1) IC15.3(A2) IC15.4(VSS) IC15.7(WP) PB1.3 PB1.4
P3V3MP: C21.1 C25.1 C26.1 C27.1 IC12.8(VCC) IC13.7(A0) IC13.8(VCC) IC14.16(VCC) IC15.8(VCC) LDx.1(A) LDy.1(A) LED17.A R14.1 R15.1 R16.1 R31.1 R32.1
P2: IC14.12(I/O_7) R7.1
P2_BLUE: LDy.2(C) R7.2
P3: IC14.11(I/O_6) R8.1
P3_GREEN: LDx.2(C) R8.2
P4: IC14.10(I/O_5) R9.1
P4_RED: LED17.K R9.2
RTM_IO0: IC14.13(~{INT}) R15.2 ; port INT
NetIC12_1: IC12.1(SDA) IC13.1(SDA) IC14.15(SDA) IC15.5(SDA) R32.2 ; port SDA
NetIC12_2: IC12.2(SCL) IC13.2(SCL) IC14.14(SCL) IC15.6(SCL) R31.2 ; port SCL
NetIC12_3: IC12.3(O.S.) IC13.3(O.S.) IC14.9(I/O_4) R14.2
NetIC14_4: IC14.4(I/O_0) PB1.1 PB1.2 R16.2

Not connected (* = marked no-connect by the designer): IC12 5(A2); IC14 5(I/O_1) 6(I/O_2) 7(I/O_3)

### Notes on the sheet
- brakuje PU do I2C
  Using I2C communication OC signals in the user zone are assumed to be terminated on the µRTM side.
- Dodane PU.
  Rezystor R15 podpięty bezpośrednio do P3V3MP
- 24LC64T A6-A3 = 1010
  PCA9554 A6-A3 = 0100
  LM75      A6-A3 =  1001
- Project/Equipment
- Document
- uTCA RTM 8 SFP+
- Designer
- Drawn by
- Check.by
- Copyright Creotech Instruments SA 2014.
  This documentation describes Open Hardware and is licensed under the CERN OHL v.1.1. You may redistribute and modify this documentation under the terms of the CERN OHL v.1.1. (http://ohwr.org/CERNOHL). This documentation is distributed WITHOUT ANY EXPRESS OR IMPLIED WARRANTY, INCLUDING OF MERCHANTABILITY, SATISFACTORY QUALITY AND FITNESS FOR A PARTICULAR PURPOSE. Please see the CERN OHL v.1.1 for applicable conditions.
- Creotech Instruments S.A.
- File
- Last Mod.
- Print Date
- Sheet
- Size
- A3
- of
- Rev
- (in symbol LED_AVAGO_HSME-C120) Green
- (in symbol R0402_10K_1%_0.0625W_100PPM) 1%
- (in symbol R0603_330R_1%_0.1W_100PPM) 1%
- (in symbol SW_C&K_HDT0001) 1,2; 3,4

### Library data of the parts
C21 C25-C27 = CC0402_100NF_16V_10%_X7R: as C1 on sheet Serial_Registers; Part Number: CC0402_100NF_16V_10%_X7R; Component Kind: Standard; Component Type: Standard; Pin Count: 2; Value: 100nF; Status: Not Recommended; Manufacturer Part Number: CC0402_100NF_16V_10%_X7R; Case: 0402; Mounted: Yes; Socket: No; SMD: Yes; Manufacturer1 Example: PHYCOMP; Manufacturer1 ComponentHeight: 0.55mm; HelpURL: \\cern.ch\dfs\Applications\Altium\Datasheets\CC0402_X7R_PHYCOMP.pdf; Author: CERN DEM JLC; CreateDate: 12/3/2007; LatestRevisionDate: 12/3/2007
IC12 IC13 = SENS_LM75: I2C temperature sensor
IC14 = PCA9554D: 8-bit I2C-bus SMBus I/O port with interrupt; Manufacturer1 PN: PCA9554D,112; Manufacturer1: NXP Semiconductors; Distributor1: Digikey; Distributor1 PN: 568-1053-5-ND
IC15 = 24LC64-I/MS: 64K I2C Serial EEPROM; Part Description: 2.5V-5.5V, 64K (8K x 8-bit) I2C Serial EEPROM; Manufacturer: MICROCHIP TECHNOLOGY; Table: Logic; Part Number: 24LC64-I/MS; Component Kind: Standard; Component Type: Standard; Device: 24LC64-I/MS; PackageDescription: SOP, 0.65mm pitch; 8 pin, 3.00mm W X 3.00mm L X 1.10mm H body, IPC Medium Density; Manufacturer Part Number: 24LC64-I/MS; Pin Count: 8; Case: MSOP8; Mounted: Yes; Socket: No; SMD: Yes; ComponentHeight: 1.1mm; HelpURL: \\cern.ch\dfs\Applications\Altium\Datasheets\24LC64-I-MS.pdf; Author: CERN DEM JLC; CreateDate: 2011-01-24; LatestRevisionDate: 2011-01-24
LDx = LED_SMD_90deg_mini_G: LED Green Avago C120; Part Description: High Performance Right Angle Chip Green LED; Manufacturer: AVAGO TECHNOLOGIES; Manufacturer Part Number: HSME-C120; Table: LEDs & Displays; Part Number: LED_AVAGO_HSME-C120; Component Kind: Standard; Component Type: Standard; Color: Green; PackageDescription: Green Chip LED, 2-Leads, Body 1.7x1.1mm, Side Emitting Package; Pin Count: 2; Mounted: Yes; Socket: No; SMD: Yes; ComponentHeight: 0.7mm; HelpURL: \\cern.ch\dfs\Applications\Altium\Datasheets\LED_AVAGO_HSME-C120.pdf; ComponentLink1URL: \\cern.ch\dfs\Applications\Altium\Datasheets\LED_AVAGO_HSME-C110_DESIGN-GUIDE.pdf; ComponentLink1Description: Design Guide; Author: CERN DEM JMW; CreateDate: 2009-07-22; LatestRevisionDate: 2012-06-20
LDy = LED_SMD_90deg_mini_B: LED Blue Avago C120; Part Number: LED_AVAGO_HSMR-C120; Part Description: High Performance Right Angle Chip Blue LED; Manufacturer: AVAGO TECHNOLOGIES; Manufacturer Part Number: HSMR-C120; Table: LEDs & Displays; Component Kind: Standard; Component Type: Standard; Color: Blue; Footprint: LED_AVAGO_HSMR-C120; PackageDescription: Blue Chip LED, 2-Leads, Body 1.7x1.1mm, Side Emitting Package; Pin Count: 2; Mounted: Yes; Socket: No; SMD: Yes; ComponentHeight: 0.7mm; HelpURL: \\cern.ch\dfs\Applications\Altium\Datasheets\LED_AVAGO_HSME-C120.pdf; ComponentLink1URL: \\cern.ch\dfs\Applications\Altium\Datasheets\LED_AVAGO_HSME-C110_DESIGN-GUIDE.pdf; ComponentLink1Description: Design Guide; Author: CERN DEM JMW; CreateDate: 2009-07-22; LatestRevisionDate: 2012-06-20
LED17 = LED_0603R: LED 0603 red; Supplier 1: Newark; Supplier Part Number 1: 22M3004; Supplier 2: Newark; Supplier Part Number 2: 20M0618
PB1 = SW_C&K_HDT0001: Push-Button Switch SPDT; Part Description: 5VDC 1mA SPST-NO Micro Mini Surface Surface Mount Detect Push-Button Switch, HDT Serie; Manufacturer: C&K; Table: Switches; Part Number: SW_C&K_HDT0001; Component Kind: Standard; Component Type: Standard; Pin Count: 4; PackageDescription: Body 3.5x2.8mm, Micro Mini Surface Mount Detect Switches, HDT Serie; Family: Push Button; Mounted: Yes; Socket: No; SMD: Yes; Status: None; Manufacturer Part Number: HDT0001; ComponentHeight: 3.35mm; HelpURL: \\cern.ch\dfs\Applications\Altium\Datasheets\SW_C&K_HDT0001.pdf; Author: CERN DEM JLC; CreateDate: 2012-08-15; LatestRevisionDate: 2012-08-15
R7-R9 = R0603_330R_1%_0.1W_100PPM: Resistor - 1%; Part Description: General Purpose Thick Film Chip Resistor; Manufacturer: GENERIC; Manufacturer1 Part Number: NRC06F3300TRF; Power: 0.1W; TC: ±100ppm/°C; Table: Resistors SMD; Part Number: R0603_330R_1%_0.1W_100PPM; Component Kind: Standard; Component Type: Standard; Pin Count: 2; Value: 330; Status: Preferred; Tolerance: ±1%; Manufacturer Part Number: R0603_330R_1%_0.1W_100PPM; Case: 0603; Mounted: Yes; Socket: No; SMD: Yes; Manufacturer1 Example: NIC COMPONENT; Manufacturer1 ComponentHeight: 0.55mm; HelpURL: \\cern.ch\dfs\Applications\Altium\Datasheets\R0603_NIC_NRC.pdf; Author: CERN DEM JLC; CreateDate: 2007-12-03; LatestRevisionDate: 2008-03-13
R14-R16 R31 R32 = R0402_10K_1%_0.0625W_100PPM: Resistor - 1%; Part Description: General Purpose Thick Film Chip Resistor; Manufacturer: GENERIC; Manufacturer1 Part Number: 232270671003L; TC: ±100ppm/°C; Table: Resistors SMD; Part Number: R0402_10K_1%_0.0625W_100PPM; Component Kind: Standard; Component Type: Standard; Pin Count: 2; Value: 10k; Status: Not recommended; Power: 0.0625W; Tolerance: ±1%; Manufacturer Part Number: R0402_10K_1%_0.0625W_100PPM; Case: 0402; Mounted: Yes; Socket: No; SMD: Yes; Manufacturer1 Example: YAGEO PHYCOMP; Manufacturer1 ComponentHeight: 0.4mm; HelpURL: \\cern.ch\dfs\Applications\Altium\Datasheets\R0402_Phycomp_RC0402.pdf; Author: CERN DEM JLC; CreateDate: 2007-12-03; LatestRevisionDate: 2012-10-17

## Sheet PWR.SchDoc
size A4; Organization: Altium Limited; Address1: L3, 12a Rodborough Rd; Address2: Frenchs Forest; Address3: NSW; Address4: Australia 2086
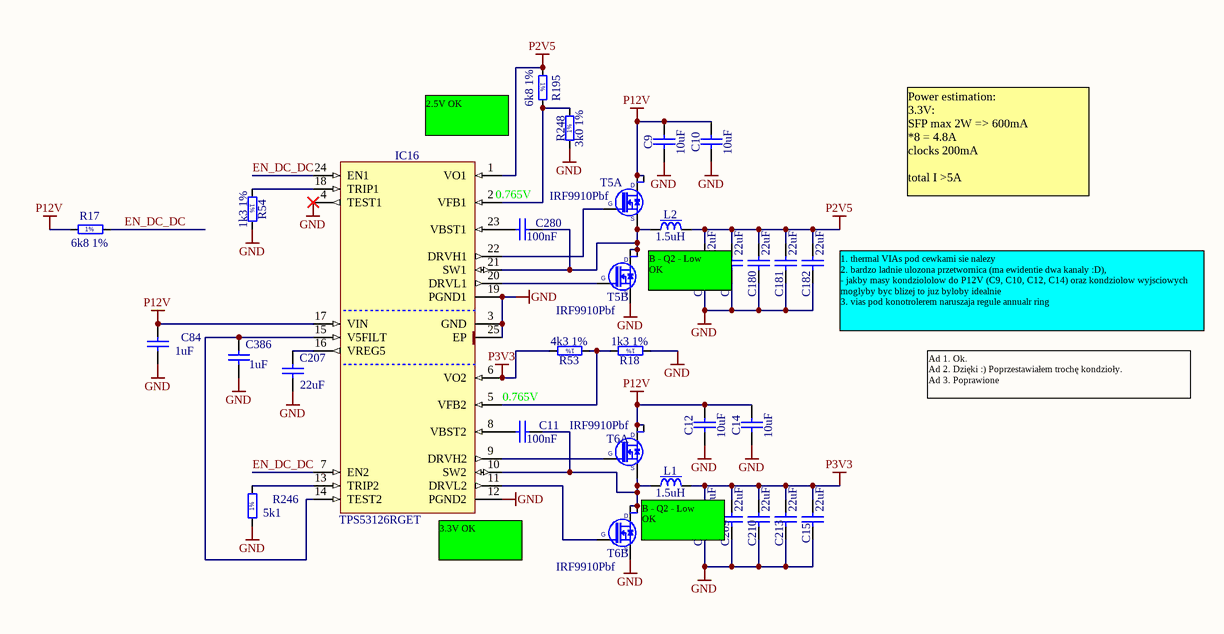
[diagram p7: PWR.SchDoc]

### Parts
C9  10uF  [CAPC3216X140N]
C10  10uF  [CAPC3216X140N]
C11  100nF  [CAPC1608X87N]
C12  10uF  [CAPC3216X140N]
C14  10uF  [CAPC3216X140N]
C15  22uF  [CAPC3216X180N]
C84  1uF  [CAPC1608X87N]
C176  22uF  [CAPC3216X180N]
C179  22uF  [CAPC3216X180N]
C180  22uF  [CAPC3216X180N]
C181  22uF  [CAPC3216X180N]
C182  22uF  [CAPC3216X180N]
C207  22uF  [CAPC3216X180N]
C208  22uF  [CAPC3216X180N]
C209  22uF  [CAPC3216X180N]
C210  22uF  [CAPC3216X180N]
C213  22uF  [CAPC3216X180N]
C280  100nF  [CAPC1608X87N]
C386  1uF  [CAPC1608X87N]
IC16  TPS53126RGET  [QFN50P400X400X100-25N-S255]
L1  1.5uH  [INDM6965X300N]
L2  1.5uH  [INDM6965X300N]
R17  6k8 1%  [0603R]
R18  1k3 1%  [0603R]
R53  4k3 1%  [0603R]
R54  1k3 1%  [0603R]
R195  6k8 1%  [0603R]
R246  5k1  [RESC1608X55N]
R248  3k0 1%  [0603R]
T5  IRF9910Pbf  [SOIC127P600X175-8N]  (parts A,B of 2)
T6  IRF9910Pbf  [SOIC127P600X175-8N]  (parts A,B of 2)

### Nets
GND: C9.1 C10.1 C12.1 C14.1 C15.1 C84.2 C176.1 C179.1 C180.1 C181.1 C182.1 C207.1 C208.1 C209.1 C210.1 C213.1 C386.1 IC16.3(GND) IC16.4(TEST1) IC16.12(PGND2) IC16.19(PGND1) IC16.25(EP) R18.1 R54.2 R246.1 R248.1 T5.1(S) T6.1(S)
P2V5: C176.2 C179.2 C180.2 C181.2 C182.2 IC16.1(VO1) L2.2 R195.1
P3V3: C15.2 C208.2 C209.2 C210.2 C213.2 IC16.6(VO2) L1.2 R53.2
P12V: C9.2 C10.2 C12.2 C14.2 C84.1 IC16.17(VIN) R17.1 T5.5(D) T5.6(D) T6.5(D) T6.6(D)
EN_DC_DC: IC16.7(EN2) IC16.24(EN1) R17.2
NetC11_1: C11.1 IC16.10(SW2) L1.1 T6.3(S) T6.7(D) T6.8(D)
NetC11_2: C11.2 IC16.8(VBST2)
NetC207_2: C207.2 IC16.16(VREG5)
NetC280_1: C280.1 IC16.21(SW1) L2.1 T5.3(S) T5.7(D) T5.8(D)
NetC280_2: C280.2 IC16.23(VBST1)
NetC386_2: C386.2 IC16.14(TEST2) IC16.15(V5FILT)
NetIC16_2: IC16.2(VFB1) R195.2 R248.2
NetIC16_5: IC16.5(VFB2) R18.2 R53.1
NetIC16_9: IC16.9(DRVH2) T6.4(G)
NetIC16_11: IC16.11(DRVL2) T6.2(G)
NetIC16_13: IC16.13(TRIP2) R246.2
NetIC16_18: IC16.18(TRIP1) R54.1
NetIC16_20: IC16.20(DRVL1) T5.2(G)
NetIC16_22: IC16.22(DRVH1) T5.4(G)

### Notes on the sheet
- 2.5V OK
- 0.765V
- Power estimation:
  3.3V:
  SFP max 2W => 600mA
  *8 = 4.8A
  clocks 200mA
  total I >5A
- B - Q2 - Low
  OK
- (near C182) 1. thermal VIAs pod cewkami sie nalezy
  2. bardzo ladnie ulozona przetwornica (ma ewidentie dwa kanaly :D),
  - jakby masy kondziololow do P12V (C9, C10, C12, C14) oraz kondziolow wyjsciowych moglyby byc blizej to juz byloby idealnie
  3. vias pod konotrolerem naruszaja regule annualr ring
- Ad 1. Ok.
  Ad 2. Dzięki :) Poprzestawiałem trochę kondzioły.
  Ad 3. Poprawione
- (near IC16) 3.3V OK
- Title
- Size:
- Date:
- A4
- Number:
- Time:
- Revision:
- Sheet
- of
- File:
- (in symbol R0603_1K3_1%_0.1W_100PPM) 1%
- (in symbol R0603_3K_1%_0.1W_100PPM) 1%
- (in symbol R0603_4K3_1%_0.1W_100PPM) 1%
- (in symbol R0603_5K1_1%_0.1W_100PPM) 1%
- (in symbol R0603_6K8_1%_0.1W_100PPM) 1%

### Library data of the parts
C9 C10 C12 C14 = CC1206_10UF_16V_10%_X7R: Non-polarised capacitor; Part Description: SMD Multilayer Chip Ceramic Capacitor; Manufacturer: GENERIC; Manufacturer1 Part Number: C1206C106K4RAC; Voltage: 16V; TC: X7R; Tolerance: ±10%; Table: Capacitors SMD; Part Number: CC1206_10UF_16V_10%_X7R; Component Kind: Standard; Component Type: Standard; Pin Count: 2; Value: 10uF; Status: Preferred; Manufacturer Part Number: CC1206_10uF_16V_10%_X7R; Case: 1206; Mounted: Yes; Socket: No; SMD: Yes; Manufacturer1 Example: KEMET; Manufacturer1 ComponentHeight: 1.8mm; HelpURL: \\cern.ch\dfs\Applications\Altium\Datasheets\CC1206_X7R_KEMET.pdf; Author: CERN DEM JLC; CreateDate: 2009-04-28; LatestRevisionDate: 2009-04-28
C11 C280 = CC0603_100NF_50V_10%_X7R: Non-polarised capacitor; Part Description: SMD Multilayer Chip Ceramic Capacitor; Manufacturer: GENERIC; Manufacturer1 Part Number: 223858615649; Voltage: 50V; TC: X7R; Tolerance: ±10%; Table: Capacitors SMD; Part Number: CC0603_100NF_50V_10%_X7R; Component Kind: Standard; Component Type: Standard; Pin Count: 2; Value: 100nF; Status: Preferred; Manufacturer Part Number: CC0603_100NF_50V_10%_X7R; Case: 0603; Mounted: Yes; Socket: No; SMD: Yes; Manufacturer1 Example: PHYCOMP; Manufacturer1 ComponentHeight: 0.87mm; HelpURL: \\cern.ch\dfs\Applications\Altium\Datasheets\CC0603_X7R_PHYCOMP.pdf; Author: CERN DEM JLC; CreateDate: 2007-12-03; LatestRevisionDate: 2007-12-03
C15 C176 C179-C182 C207-C210 C213 = CC1206_22UF_10V_10%_X7R: Non-polarised capacitor; Part Description: SMD Multilayer Chip Ceramic Capacitor; Manufacturer: GENERIC; Manufacturer1 Part Number: GRM31CR71A226KE15L; Voltage: 10V; TC: X7R; Tolerance: ±10%; Table: Capacitors SMD; Part Number: CC1206_22UF_10V_10%_X7R; Component Kind: Standard; Component Type: Standard; Pin Count: 2; Value: 22uF; Status: Preferred; Manufacturer Part Number: CC1206_22UF_10V_10%_X7R; Case: 1206; Mounted: Yes; Socket: No; SMD: Yes; Manufacturer1 Example: MURATA; Manufacturer1 ComponentHeight: 1.8mm; HelpURL: \\cern.ch\dfs\Applications\Altium\Datasheets\CC1206_X7R_MURATA_GRM-HI-CAP.pdf; Author: CERN DEM JLC; CreateDate: 2010-06-08; LatestRevisionDate: 2010-06-08
C84 C386 = CC0603_1UF_16V_10%_X7R: Non-polarised capacitor; Part Description: SMD Multilayer Chip Ceramic Capacitor; Manufacturer: GENERIC; Manufacturer1 Part Number: 223824613663; Voltage: 16V; TC: X7R; Tolerance: ±10%; Table: Capacitors SMD; Part Number: CC0603_1UF_16V_10%_X7R; Component Kind: Standard; Component Type: Standard; Pin Count: 2; Value: 1uF; Status: Preferred; Manufacturer Part Number: CC0603_1uF_16V_10%_X7R; Case: 0603; Mounted: Yes; Socket: No; SMD: Yes; Manufacturer1 Example: PHYCOMP; Manufacturer1 ComponentHeight: 0.87mm; HelpURL: \\cern.ch\dfs\Applications\Altium\Datasheets\CC0805_X5R_PHYCOMP_HC.pdf; Author: CERN DEM JLC
  C84: CreateDate: 12/3/2007; LatestRevisionDate: 12/3/2007
  C386: CreateDate: 03/12/2007; LatestRevisionDate: 03/12/2007
IC16 = TPS53126RGET: Dual Synchronous Step-Down Controller For Low Voltage Power Rails; Manufacturer: TEXAS INSTRUMENTS; Table: Analog & Interface; Part Number: TPS53126RGET; Component Kind: Standard; Component Type: Standard; Device: TPS53126RGET; PackageDescription: QFN,0.50mm pitch,square;6 pin X 6 pin,4.15mm X 4.15mm X 1.00mm H body (w/thermal tab 2.55 X 2.55mm),  IPC Medium Density; Part Description: Dual Synchronous Step-Down Controller For Low Voltage Power Rails; Manufacturer Part Number: TPS53126RGET; Pin Count: 25; Case: QFN24; Mounted: Yes; Socket: No; SMD: Yes; ComponentHeight: 1.0mm; Author: CERN DEM JLC; HelpURL: \\cern.ch\dfs\Applications\Altium\Datasheets\TPS53126RGET.pdf; CreateDate: 2010-08-26; LatestRevisionDate: 2010-08-26
L1 L2 = IND2525_1.5UH_20%_VISHAY_IHLP-2525CZ: Inductor With Magnetic core; Part Description: Low Profile, High Current IHLP® Inductor; Manufacturer: VISHAY DALE; Manufacturer Part Number: IHLP2525CZER1R5M01; Power: 9A; Resistance: 0.014R; Tolerance: ±20%; Table: Inductors SMD; Part Number: IND2525_1.5UH_20%_VISHAY_IHLP-2525CZ; Component Kind: Standard; Component Type: Standard; Pin Count: 2; Value: 1.5uH; Status: None; Case: 2525; Mounted: Yes; Socket: No; SMD: Yes; ComponentHeight: 3mm; HelpURL: \\cern.ch\dfs\Applications\Altium\Datasheets\IND2525_VISHAY_IHLP-2525CZ.pdf; Author: CERN DEM JLC; CreateDate: 2012-10-24; LatestRevisionDate: 2012-10-24
R17 R195 = R0603_6K8_1%_0.1W_100PPM: Resistor - 1%; Part Description: General Purpose Thick Film Chip Resistor; Manufacturer: GENERIC; Manufacturer1 Part Number: NRC06F6801TRF; Power: 0.1W; TC: ±100ppm/°C; Table: Resistors SMD; Part Number: R0603_6K8_1%_0.1W_100PPM; Component Kind: Standard; Component Type: Standard; Footprint: RESC1608X55N; Pin Count: 2; Value: 6k8; Status: Preferred; Tolerance: ±1%; Manufacturer Part Number: R0603_6K8_1%_0.1W_100PPM; Case: 0603; Mounted: Yes; Socket: No; SMD: Yes; Manufacturer1 Example: NIC COMPONENT; Manufacturer1 ComponentHeight: 0.55mm; HelpURL: \\cern.ch\dfs\Applications\Altium\Datasheets\R0603_NIC_NRC.pdf; Author: CERN DEM JLC; CreateDate: 2007-12-03; LatestRevisionDate: 2008-03-13
R18 R54 = R0603_1K3_1%_0.1W_100PPM: Resistor - 1%; Part Description: General Purpose Thick Film Chip Resistor; Manufacturer: GENERIC; Manufacturer1 Part Number: NRC06F1301TRF; Power: 0.1W; TC: ±100ppm/°C; Table: Resistors SMD; Part Number: R0603_1K3_1%_0.1W_100PPM; Component Kind: Standard; Component Type: Standard; Footprint: RESC1608X55N; Pin Count: 2; Value: 1k3; Status: Preferred; Tolerance: ±1%; Manufacturer Part Number: R0603_1K3_1%_0.1W_100PPM; Case: 0603; Mounted: Yes; Socket: No; SMD: Yes; Manufacturer1 Example: NIC COMPONENT; Manufacturer1 ComponentHeight: 0.55mm; HelpURL: \\cern.ch\dfs\Applications\Altium\Datasheets\R0603_NIC_NRC.pdf; Author: CERN DEM JLC; CreateDate: 2007-12-03; LatestRevisionDate: 2008-03-13
R53 = R0603_4K3_1%_0.1W_100PPM: Resistor - 1%; Part Description: General Purpose Thick Film Chip Resistor; Manufacturer: GENERIC; Manufacturer1 Part Number: NRC06F4301TRF; Power: 0.1W; TC: ±100ppm/°C; Table: Resistors SMD; Part Number: R0603_4K3_1%_0.1W_100PPM; Component Kind: Standard; Component Type: Standard; Footprint: RESC1608X55N; Pin Count: 2; Value: 4k3; Status: Preferred; Tolerance: ±1%; Manufacturer Part Number: R0603_4K3_1%_0.1W_100PPM; Case: 0603; Mounted: Yes; Socket: No; SMD: Yes; Manufacturer1 Example: NIC COMPONENT; Manufacturer1 ComponentHeight: 0.55mm; HelpURL: \\cern.ch\dfs\Applications\Altium\Datasheets\R0603_NIC_NRC.pdf; Author: CERN DEM JLC; CreateDate: 2007-12-03; LatestRevisionDate: 2008-03-13
R246 = R0603_5K1_1%_0.1W_100PPM: Resistor - 1%; Part Description: General Purpose Thick Film Chip Resistor; Manufacturer: GENERIC; Manufacturer1 Part Number: NRC06F5101TRF; Power: 0.1W; TC: ±100ppm/°C; Table: Resistors SMD; Part Number: R0603_5K1_1%_0.1W_100PPM; Component Kind: Standard; Component Type: Standard; Pin Count: 2; Value: 5k1; Status: Preferred; Tolerance: ±1%; Manufacturer Part Number: R0603_5K1_1%_0.1W_100PPM; Case: 0603; Mounted: Yes; Socket: No; SMD: Yes; Manufacturer1 Example: NIC COMPONENT; Manufacturer1 ComponentHeight: 0.55mm; HelpURL: \\cern.ch\dfs\Applications\Altium\Datasheets\R0603_NIC_NRC.pdf; Author: CERN DEM JLC; CreateDate: 2007-12-03; LatestRevisionDate: 2008-03-13
R248 = R0603_3K_1%_0.1W_100PPM: Resistor - 1%; Part Description: General Purpose Thick Film Chip Resistor; Manufacturer: GENERIC; Manufacturer1 Part Number: NRC06F3001TRF; Value: 3k; Power: 0.1W; TC: ±100ppm/°C; Table: Resistors SMD; Part Number: R0603_3K_1%_0.1W_100PPM; Component Kind: Standard; Component Type: Standard; Footprint: RESC1608X55N; Pin Count: 2; Status: Preferred; Tolerance: ±1%; Manufacturer Part Number: R0603_3K_1%_0.1W_100PPM; Case: 0603; Mounted: Yes; Socket: No; SMD: Yes; Manufacturer1 Example: NIC COMPONENT; Manufacturer1 ComponentHeight: 0.55mm; HelpURL: \\cern.ch\dfs\Applications\Altium\Datasheets\R0603_NIC_NRC.pdf; Author: CERN DEM JLC; CreateDate: 2007-12-03; LatestRevisionDate: 2008-03-13
T5 T6 = IRF9910Pbf: Dual SO-8 MOSFET For POL Cconverter; Part Description: 20V 10A(Q1) 20V 12A (Q2) Dual SO-8 MOSFET For POL Cconverter; Manufacturer: INTERNATIONAL RECTIFIER; Table: Transistors; Part Number: IRF9910Pbf; Component Kind: Standard; Component Type: Standard; Device: IRF9910Pbf; PackageDescription: SOIC 8, Pitch 1.27mm - Body 4x5mm, IPC Medium Density; Manufacturer Part Number: IRF9910Pbf; Pin Count: 8; Case: DO8; Mounted: Yes; Socket: No; SMD: Yes; ComponentHeight: 1.75mm; HelpURL: \\cern.ch\dfs\Applications\Altium\Datasheets\IRF9910Pbf.pdf; Author: CERN DEM JLC; CreateDate: 2010-08-30; LatestRevisionDate: 2010-08-30

## Nets that join several sheets
GND: RTM_SFP_TOP (93 pins), U_SFP (18 pins), I2C_Switch (6 pins), Clock_Distribution (16 pins), Serial_Registers (30 pins), U_SFP (18 pins), U_SFP (18 pins), U_SFP (18 pins), U_SFP (18 pins), U_SFP (18 pins), U_SFP (18 pins), U_SFP (18 pins), RTM_Connectors (70 pins), USR_IO_IPMI (21 pins), PWR (28 pins)
P2V5: Clock_Distribution (L20.1), PWR (8 pins)
P3V3: U_SFP (11 pins), I2C_Switch (23 pins), Clock_Distribution (L19.1), Serial_Registers (20 pins), U_SFP (11 pins), U_SFP (11 pins), U_SFP (11 pins), U_SFP (11 pins), U_SFP (11 pins), U_SFP (11 pins), U_SFP (11 pins), RTM_Connectors (C17.1 IC48.7 R25.1 R27.2), PWR (8 pins)
P3V3MP: RTM_Connectors (J6.c2), USR_IO_IPMI (17 pins)
P12V: RTM_Connectors (F1.2), PWR (11 pins)
FPGA_CLK1_N: Clock_Distribution (IC11.39), RTM_Connectors (J2.b5)
FPGA_CLK1_P: Clock_Distribution (IC11.38), RTM_Connectors (J2.a5)
FPGA_CLK2_N: Clock_Distribution (IC11.37), RTM_Connectors (J2.b9)
FPGA_CLK2_P: Clock_Distribution (IC11.36), RTM_Connectors (J2.a9)
NetIC12_1: RTM_Connectors (J6.d1), USR_IO_IPMI (5 pins)
NetIC12_2: RTM_Connectors (J6.d2), USR_IO_IPMI (5 pins)
RTM_IO0: RTM_Connectors (J6.c5), USR_IO_IPMI (IC14.13 R15.2)
RTM_IO1: Serial_Registers (R6.2), RTM_Connectors (J6.c6)
RTM_IO2: Serial_Registers (IC1.11 R5.2), RTM_Connectors (J6.c7)
RTM_IO3: Serial_Registers (IC1.3 R13.2), RTM_Connectors (J6.c8)
RTM_IO4: Serial_Registers (IC1.9 R2.2), RTM_Connectors (J6.c9)
RTM_IO5: Serial_Registers (IC1.5 R3.2), RTM_Connectors (J6.c10)
RTM_IO6: Serial_Registers (IC1.1 R4.2), RTM_Connectors (J2.a1)
RTM_IO8: Clock_Distribution (R391.2), RTM_Connectors (J2.c1)
RTM_IO9: Clock_Distribution (OSC1.2 R311.1), RTM_Connectors (J2.c2)
RTM_IO10: I2C_Switch (IC39.19 R325.1), Clock_Distribution (OSC1.8), RTM_Connectors (J2.e1)
RTM_IO11: I2C_Switch (IC39.20 R324.1), Clock_Distribution (OSC1.7), RTM_Connectors (J2.e2)
SFP1RX_N: U_SFP (J5A.12), RTM_Connectors (J2.d10)
SFP1RX_P: U_SFP (J5A.13), RTM_Connectors (J2.c10)
SFP1TX_N: U_SFP (J5A.19), RTM_Connectors (J2.f10)
SFP1TX_P: U_SFP (J5A.18), RTM_Connectors (J2.e10)
SFP2RX_N: U_SFP (J5B.12), RTM_Connectors (J2.d9)
SFP2RX_P: U_SFP (J5B.13), RTM_Connectors (J2.c9)
SFP2TX_N: U_SFP (J5B.19), RTM_Connectors (J2.f9)
SFP2TX_P: U_SFP (J5B.18), RTM_Connectors (J2.e9)
SFP3RX_N: U_SFP (J5C.12), RTM_Connectors (J2.d8)
SFP3RX_P: U_SFP (J5C.13), RTM_Connectors (J2.c8)
SFP3TX_N: U_SFP (J5C.19), RTM_Connectors (J2.f8)
SFP3TX_P: U_SFP (J5C.18), RTM_Connectors (J2.e8)
SFP4RX_N: U_SFP (J5D.12), RTM_Connectors (J2.d7)
SFP4RX_P: U_SFP (J5D.13), RTM_Connectors (J2.c7)
SFP4TX_N: U_SFP (J5D.19), RTM_Connectors (J2.f7)
SFP4TX_P: U_SFP (J5D.18), RTM_Connectors (J2.e7)
SFP5RX_N: U_SFP (J5E.12), RTM_Connectors (J2.d6)
SFP5RX_P: U_SFP (J5E.13), RTM_Connectors (J2.c6)
SFP5TX_N: U_SFP (J5E.19), RTM_Connectors (J2.f6)
SFP5TX_P: U_SFP (J5E.18), RTM_Connectors (J2.e6)
SFP6RX_N: U_SFP (J5F.12), RTM_Connectors (J2.d5)
SFP6RX_P: U_SFP (J5F.13), RTM_Connectors (J2.c5)
SFP6TX_N: U_SFP (J5F.19), RTM_Connectors (J2.f5)
SFP6TX_P: U_SFP (J5F.18), RTM_Connectors (J2.e5)
SFP7RX_N: U_SFP (J5G.12), RTM_Connectors (J2.d4)
SFP7RX_P: U_SFP (J5G.13), RTM_Connectors (J2.c4)
SFP7TX_N: U_SFP (J5G.19), RTM_Connectors (J2.f4)
SFP7TX_P: U_SFP (J5G.18), RTM_Connectors (J2.e4)
SFP8RX_N: U_SFP (J5H.12), RTM_Connectors (J2.d3)
SFP8RX_P: U_SFP (J5H.13), RTM_Connectors (J2.c3)
SFP8TX_N: U_SFP (J5H.19), RTM_Connectors (J2.f3)
SFP8TX_P: U_SFP (J5H.18), RTM_Connectors (J2.e3)
SFP_CLK1.CLOCK_N: U_SFP (IC20A.4 R105A.2), Clock_Distribution (IC11.13)
SFP_CLK1.CLOCK_P: U_SFP (IC20A.3 R105A.1), Clock_Distribution (IC11.12)
SFP_CLK2.CLOCK_N: Clock_Distribution (IC11.15), U_SFP (IC20B.4 R105B.2)
SFP_CLK2.CLOCK_P: Clock_Distribution (IC11.14), U_SFP (IC20B.3 R105B.1)
SFP_CLK3.CLOCK_N: Clock_Distribution (IC11.17), U_SFP (IC20C.4 R105C.2)
SFP_CLK3.CLOCK_P: Clock_Distribution (IC11.16), U_SFP (IC20C.3 R105C.1)
SFP_CLK4.CLOCK_N: Clock_Distribution (IC11.19), U_SFP (IC20D.4 R105D.2)
SFP_CLK4.CLOCK_P: Clock_Distribution (IC11.18), U_SFP (IC20D.3 R105D.1)
SFP_CLK5.CLOCK_N: Clock_Distribution (IC11.23), U_SFP (IC20E.4 R105E.2)
SFP_CLK5.CLOCK_P: Clock_Distribution (IC11.22), U_SFP (IC20E.3 R105E.1)
SFP_CLK6.CLOCK_N: Clock_Distribution (IC11.25), U_SFP (IC20F.4 R105F.2)
SFP_CLK6.CLOCK_P: Clock_Distribution (IC11.24), U_SFP (IC20F.3 R105F.1)
SFP_CLK7.CLOCK_N: Clock_Distribution (IC11.27), U_SFP (IC20G.4 R105G.2)
SFP_CLK7.CLOCK_P: Clock_Distribution (IC11.26), U_SFP (IC20G.3 R105G.1)
SFP_CLK8.CLOCK_N: Clock_Distribution (IC11.29), U_SFP (IC20H.4 R105H.2)
SFP_CLK8.CLOCK_P: Clock_Distribution (IC11.28), U_SFP (IC20H.3 R105H.1)
SFP_DETECTn1: U_SFP (J5A.6 R403A.1), Serial_Registers (IC2.11)
SFP_DETECTn2: Serial_Registers (IC2.3), U_SFP (J5B.6 R403B.1)
SFP_DETECTn3: Serial_Registers (IC5.11), U_SFP (J5C.6 R403C.1)
SFP_DETECTn4: Serial_Registers (IC5.3), U_SFP (J5D.6 R403D.1)
SFP_DETECTn5: Serial_Registers (IC7.11), U_SFP (J5E.6 R403E.1)
SFP_DETECTn6: Serial_Registers (IC7.3), U_SFP (J5F.6 R403F.1)
SFP_DETECTn7: Serial_Registers (IC9.11), U_SFP (J5G.6 R403G.1)
SFP_DETECTn8: Serial_Registers (IC9.3), U_SFP (J5H.6 R403H.1)
SFP_I2C_1.SCL: I2C_Switch (IC39.2 R317.1), U_SFP (J5H.5)
SFP_I2C_1.SDA: I2C_Switch (IC39.1 R316.1), U_SFP (J5H.4)
SFP_I2C_2.SCL: I2C_Switch (IC39.4 R319.1), U_SFP (J5G.5)
SFP_I2C_2.SDA: I2C_Switch (IC39.3 R318.1), U_SFP (J5G.4)
SFP_I2C_3.SCL: I2C_Switch (IC39.6 R321.1), U_SFP (J5F.5)
SFP_I2C_3.SDA: I2C_Switch (IC39.5 R320.1), U_SFP (J5F.4)
SFP_I2C_4.SCL: I2C_Switch (IC39.8 R323.1), U_SFP (J5E.5)
SFP_I2C_4.SDA: I2C_Switch (IC39.7 R322.1), U_SFP (J5E.4)
SFP_I2C_5.SCL: I2C_Switch (IC39.11 R330.1), U_SFP (J5D.5)
SFP_I2C_5.SDA: I2C_Switch (IC39.10 R329.1), U_SFP (J5D.4)
SFP_I2C_6.SCL: I2C_Switch (IC39.13 R332.1), U_SFP (J5C.5)
SFP_I2C_6.SDA: I2C_Switch (IC39.12 R331.1), U_SFP (J5C.4)
SFP_I2C_7.SCL: I2C_Switch (IC39.15 R334.1), U_SFP (J5B.5)
SFP_I2C_7.SDA: I2C_Switch (IC39.14 R333.1), U_SFP (J5B.4)
SFP_I2C_8.SCL: U_SFP (J5A.5), I2C_Switch (IC39.17 R336.1)
SFP_I2C_8.SDA: U_SFP (J5A.4), I2C_Switch (IC39.16 R335.1)
SFP_LED1: U_SFP (R10A.2 T2A.1), Serial_Registers (IC2.14 IC3.7)
SFP_LED1: Serial_Registers (IC2.6 IC3.11), U_SFP (R10B.2 T2B.1)
SFP_LED1: Serial_Registers (IC4.7 IC5.14), U_SFP (R10C.2 T2C.1)
SFP_LED1: Serial_Registers (IC4.11 IC5.6), U_SFP (R10D.2 T2D.1)
SFP_LED1: Serial_Registers (IC6.7 IC7.14), U_SFP (R10E.2 T2E.1)
SFP_LED1: Serial_Registers (IC6.11 IC7.6), U_SFP (R10F.2 T2F.1)
SFP_LED1: Serial_Registers (IC8.7 IC9.14), U_SFP (R10G.2 T2G.1)
SFP_LED1: Serial_Registers (IC8.11 IC9.6), U_SFP (R10H.2 T2H.1)
SFP_LED2: U_SFP (R12A.2 T1A.1), Serial_Registers (IC10.4)
SFP_LED2: Serial_Registers (IC10.5), U_SFP (R12B.2 T1B.1)
SFP_LED2: Serial_Registers (IC10.6), U_SFP (R12C.2 T1C.1)
SFP_LED2: Serial_Registers (IC10.7), U_SFP (R12D.2 T1D.1)
SFP_LED2: Serial_Registers (IC10.14), U_SFP (R12E.2 T1E.1)
SFP_LED2: Serial_Registers (IC10.13), U_SFP (R12F.2 T1F.1)
SFP_LED2: Serial_Registers (IC10.12), U_SFP (R12G.2 T1G.1)
SFP_LED2: Serial_Registers (IC10.11), U_SFP (R12H.2 T1H.1)
SFP_LOS: U_SFP (J5A.8 R404A.1), Serial_Registers (IC2.13)
SFP_LOS: Serial_Registers (IC2.5), U_SFP (J5B.8 R404B.1)
SFP_LOS: Serial_Registers (IC5.13), U_SFP (J5C.8 R404C.1)
SFP_LOS: Serial_Registers (IC5.5), U_SFP (J5D.8 R404D.1)
SFP_LOS: Serial_Registers (IC7.13), U_SFP (J5E.8 R404E.1)
SFP_LOS: Serial_Registers (IC7.5), U_SFP (J5F.8 R404F.1)
SFP_LOS: Serial_Registers (IC9.13), U_SFP (J5G.8 R404G.1)
SFP_LOS: Serial_Registers (IC9.5), U_SFP (J5H.8 R404H.1)
SFP_RS0: U_SFP (R107A.2), Serial_Registers (IC3.5)
SFP_RS0: Serial_Registers (IC3.13), U_SFP (R107B.2)
SFP_RS0: Serial_Registers (IC4.5), U_SFP (R107C.2)
SFP_RS0: Serial_Registers (IC4.13), U_SFP (R107D.2)
SFP_RS0: Serial_Registers (IC6.5), U_SFP (R107E.2)
SFP_RS0: Serial_Registers (IC6.13), U_SFP (R107F.2)
SFP_RS0: Serial_Registers (IC8.5), U_SFP (R107G.2)
SFP_RS0: Serial_Registers (IC8.13), U_SFP (R107H.2)
SFP_RS1: U_SFP (J5A.9), Serial_Registers (IC3.6)
SFP_RS1: Serial_Registers (IC3.12), U_SFP (J5B.9)
SFP_RS1: Serial_Registers (IC4.6), U_SFP (J5C.9)
SFP_RS1: Serial_Registers (IC4.12), U_SFP (J5D.9)
SFP_RS1: Serial_Registers (IC6.6), U_SFP (J5E.9)
SFP_RS1: Serial_Registers (IC6.12), U_SFP (J5F.9)
SFP_RS1: Serial_Registers (IC8.6), U_SFP (J5G.9)
SFP_RS1: Serial_Registers (IC8.12), U_SFP (J5H.9)
SFP_TXDISABLE: U_SFP (J5A.3), Serial_Registers (IC3.4)
SFP_TXDISABLE: Serial_Registers (IC3.14), U_SFP (J5B.3)
SFP_TXDISABLE: Serial_Registers (IC4.4), U_SFP (J5C.3)
SFP_TXDISABLE: Serial_Registers (IC4.14), U_SFP (J5D.3)
SFP_TXDISABLE: Serial_Registers (IC6.4), U_SFP (J5E.3)
SFP_TXDISABLE: Serial_Registers (IC6.14), U_SFP (J5F.3)
SFP_TXDISABLE: Serial_Registers (IC8.4), U_SFP (J5G.3)
SFP_TXDISABLE: Serial_Registers (IC8.14), U_SFP (J5H.3)
SFP_TXFAULT: U_SFP (J5A.2 R400A.1), Serial_Registers (IC2.12)
SFP_TXFAULT: Serial_Registers (IC2.4), U_SFP (J5B.2 R400B.1)
SFP_TXFAULT: Serial_Registers (IC5.12), U_SFP (J5C.2 R400C.1)
SFP_TXFAULT: Serial_Registers (IC5.4), U_SFP (J5D.2 R400D.1)
SFP_TXFAULT: Serial_Registers (IC7.12), U_SFP (J5E.2 R400E.1)
SFP_TXFAULT: Serial_Registers (IC7.4), U_SFP (J5F.2 R400F.1)
SFP_TXFAULT: Serial_Registers (IC9.12), U_SFP (J5G.2 R400G.1)
SFP_TXFAULT: Serial_Registers (IC9.4), U_SFP (J5H.2 R400H.1)
SYNC_CLK_N: Clock_Distribution (C395.2), RTM_Connectors (J6.d3)
SYNC_CLK_P: Clock_Distribution (C394.2), RTM_Connectors (J6.c3)